# EAGLE schematic elk-board (EAGLE 9.4.2)
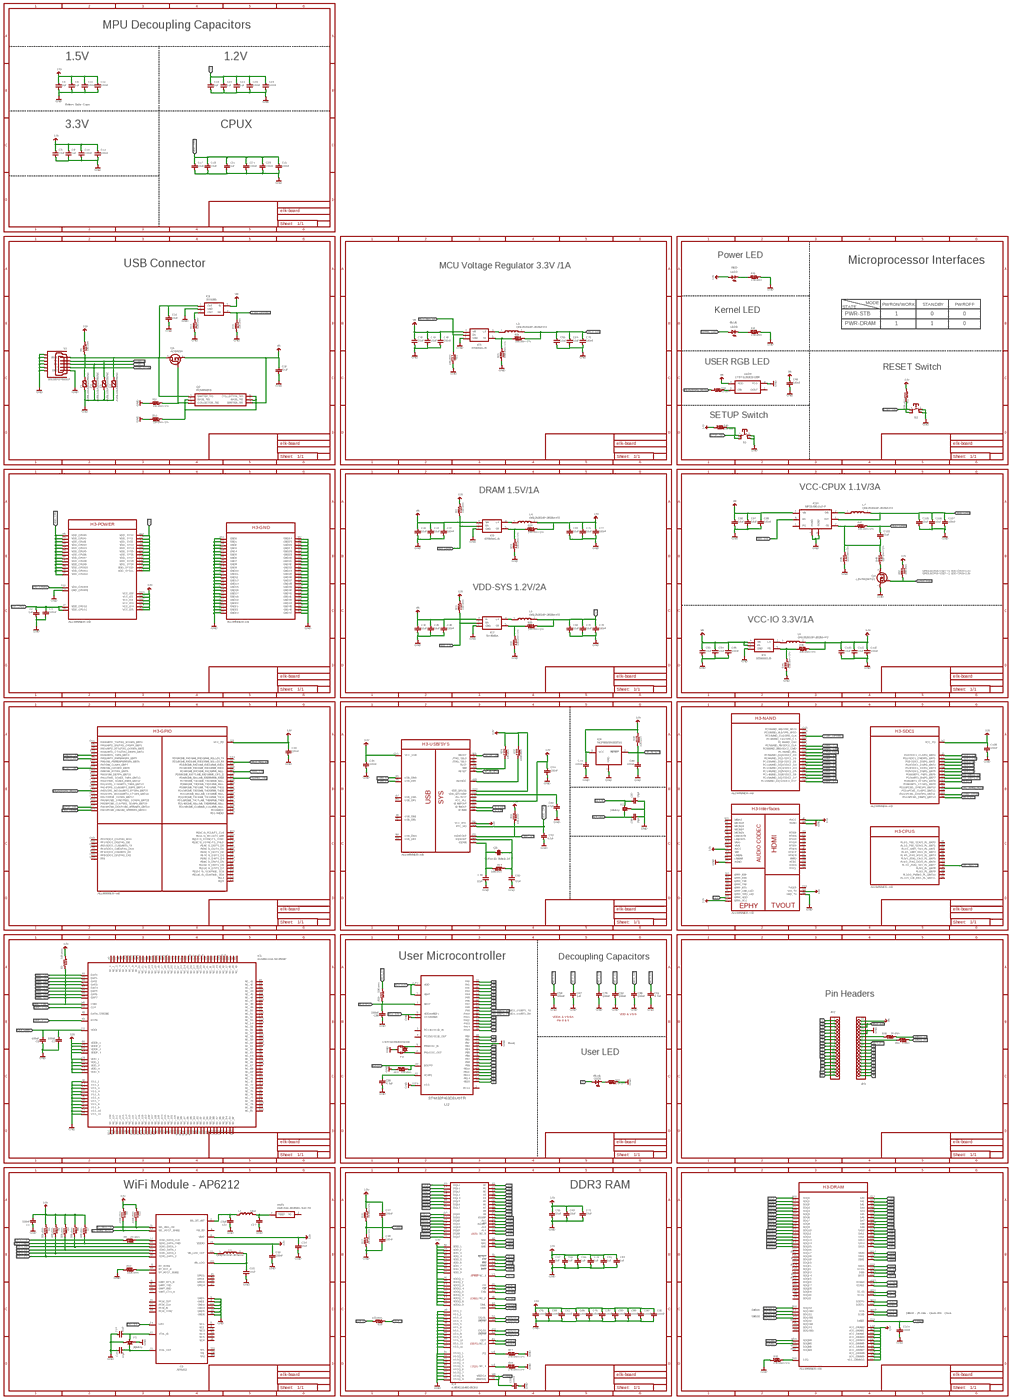
[diagram p0: schematic, sheet 1, overview]
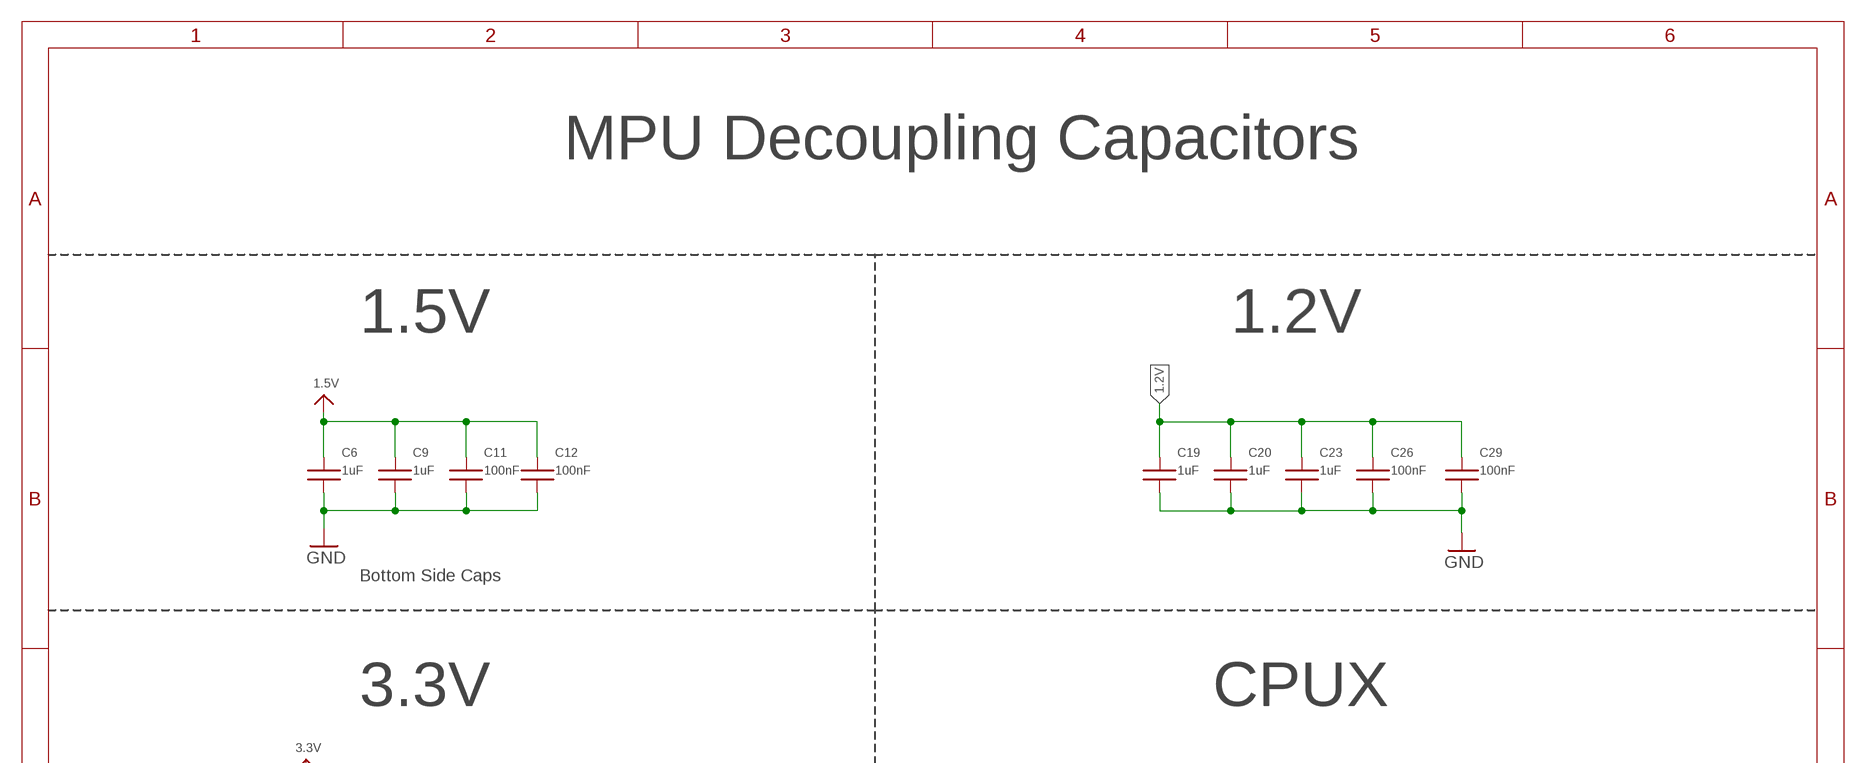
[diagram p1: schematic, sheet 1, part 1 of 7]
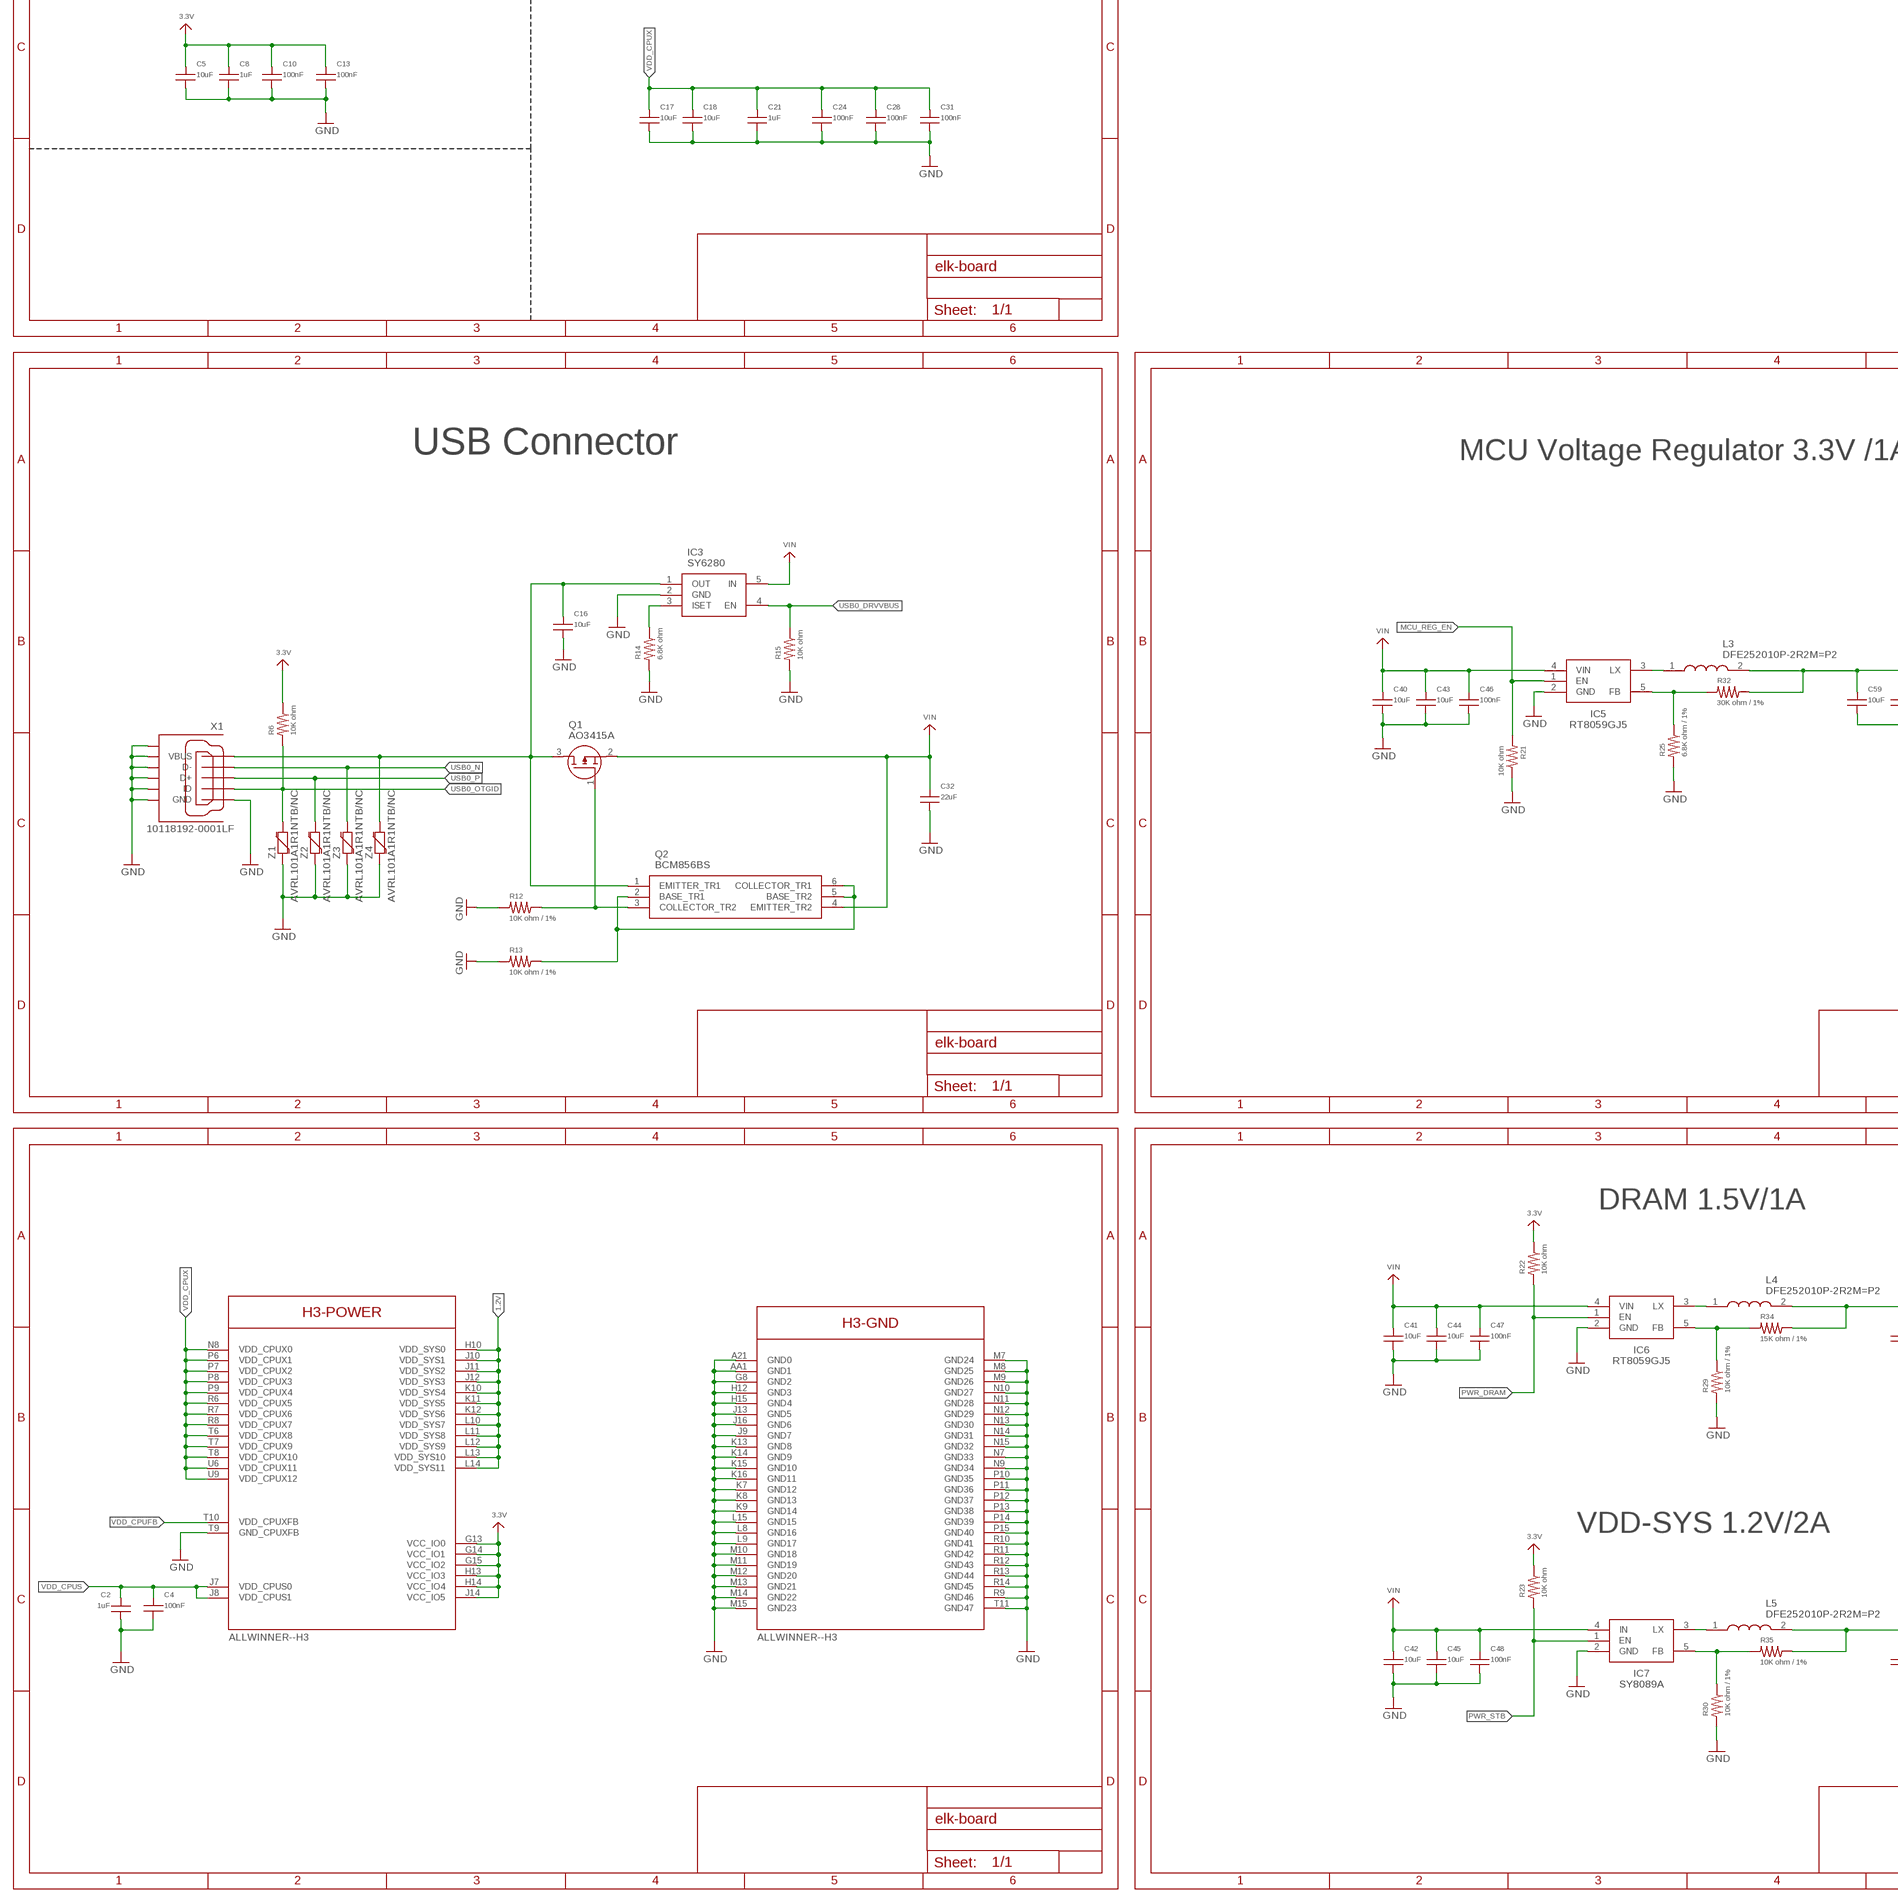
[diagram p2: schematic, sheet 1, part 2 of 7]
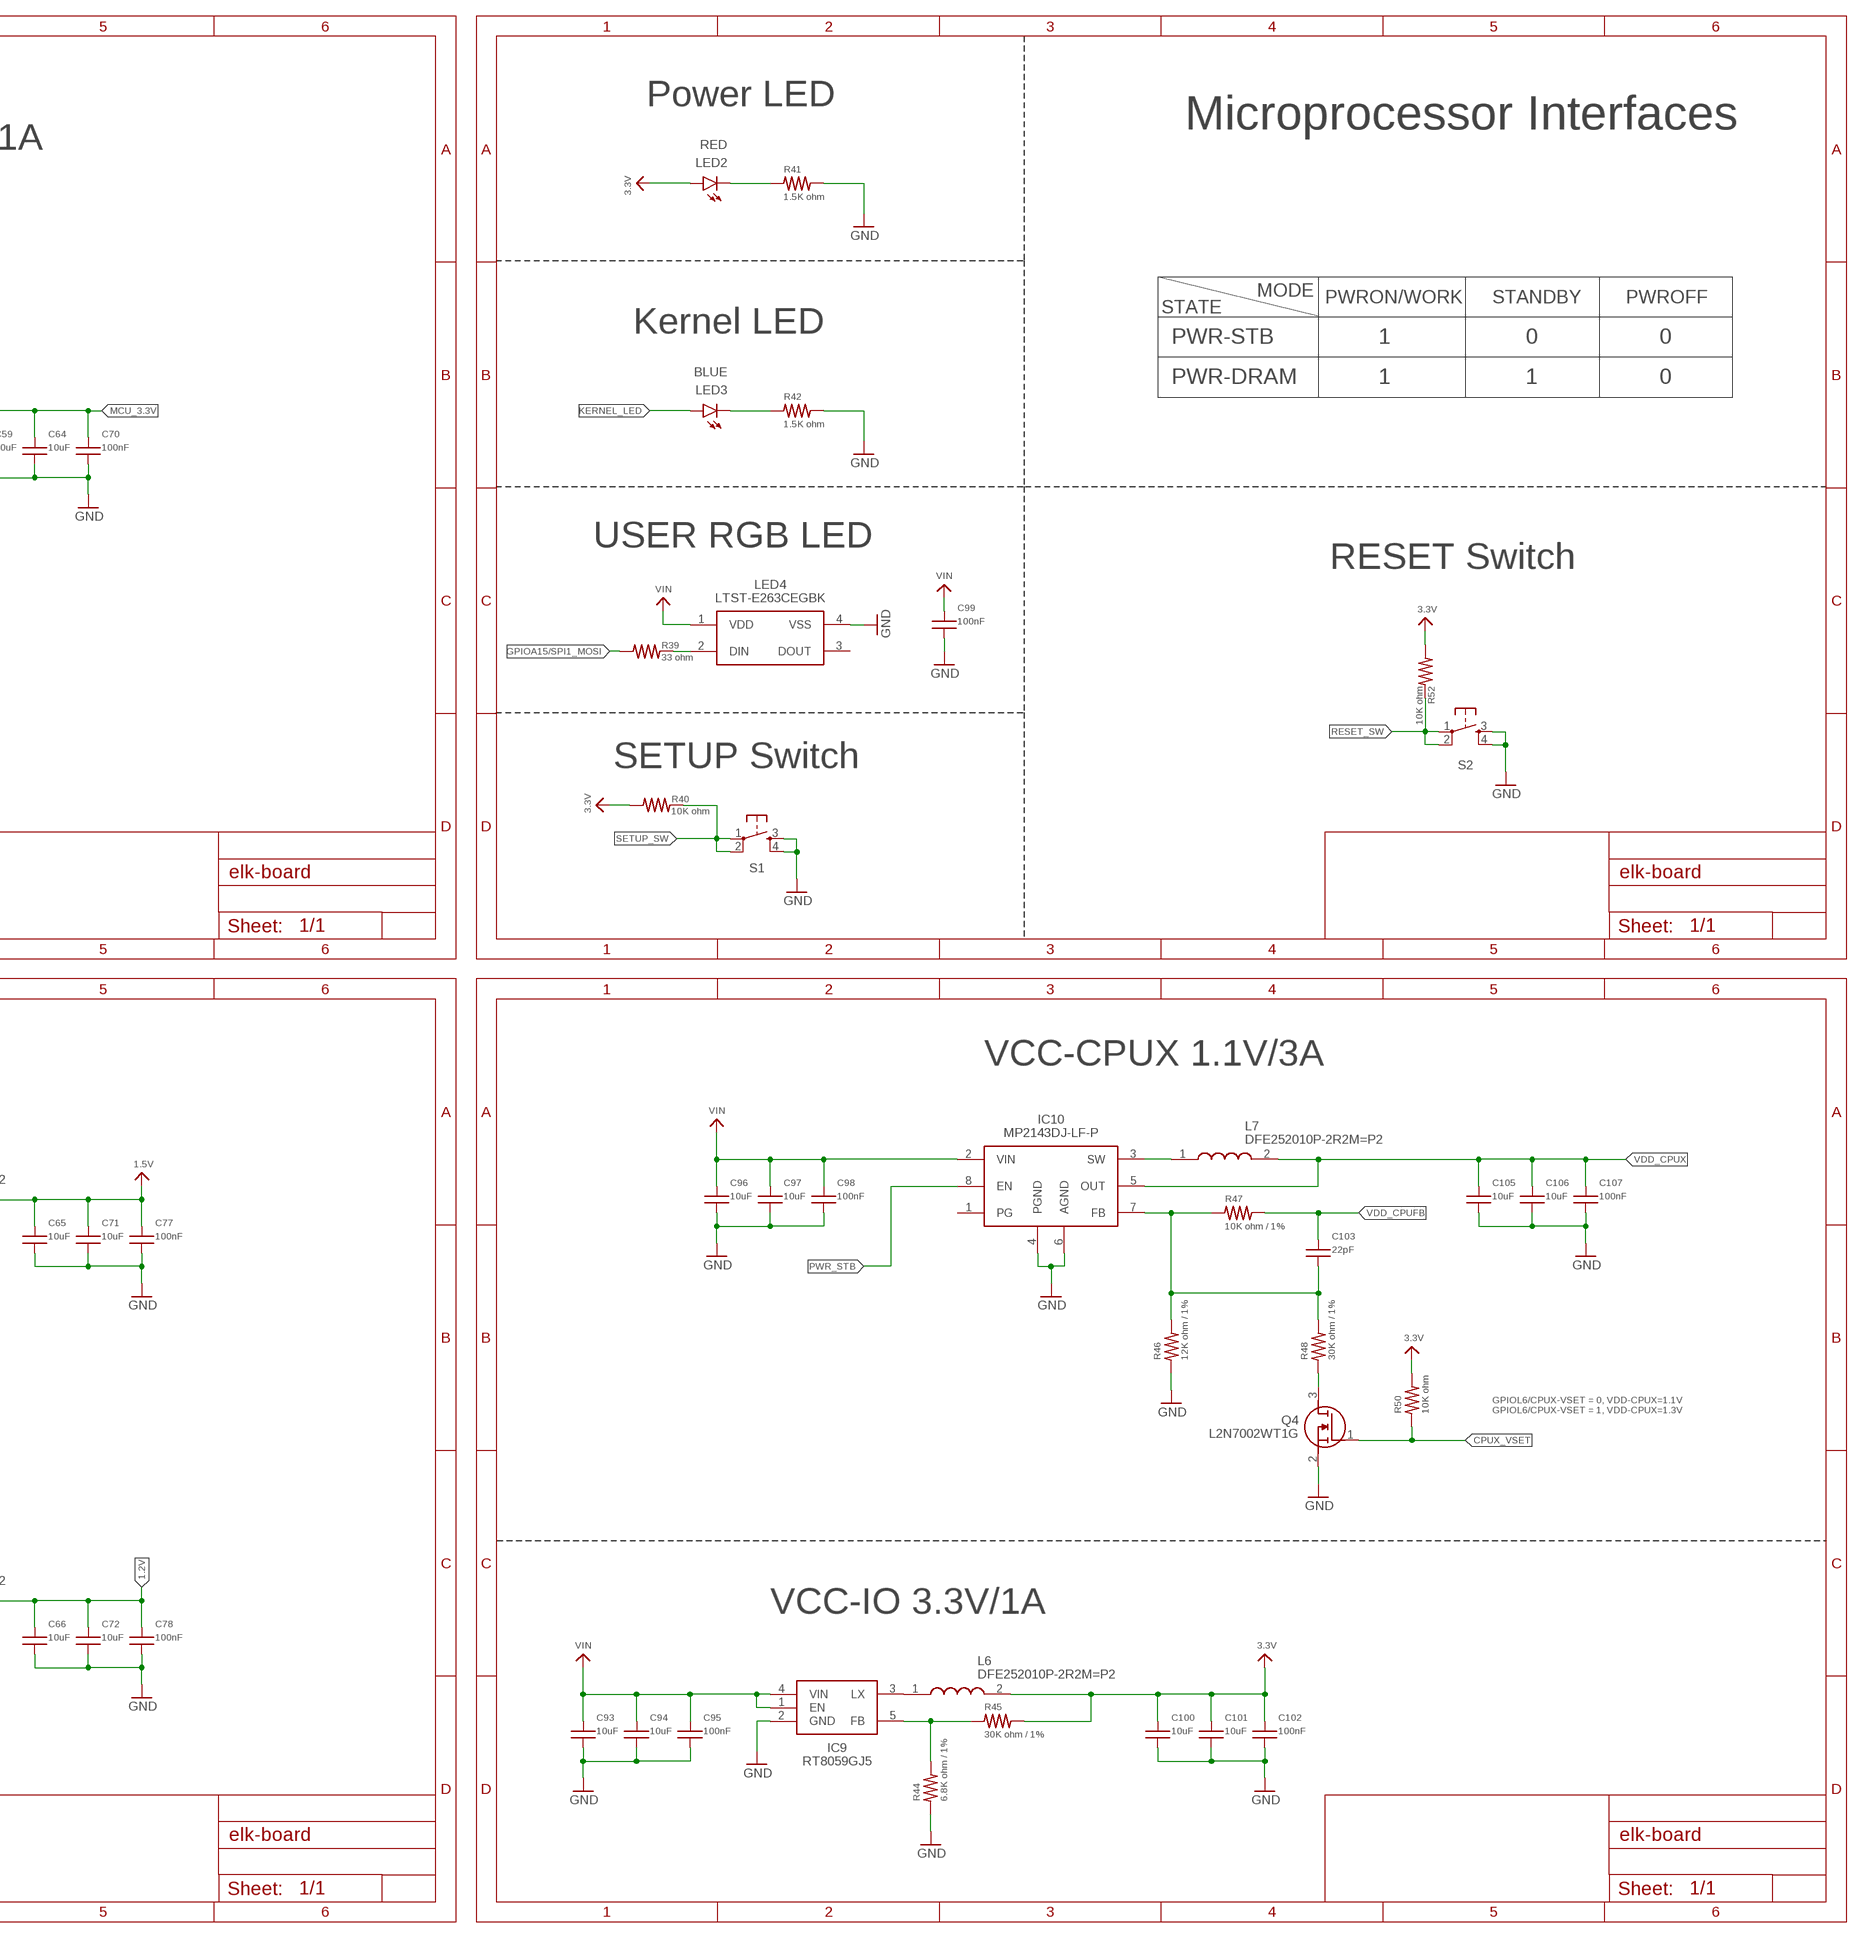
[diagram p3: schematic, sheet 1, part 3 of 7]
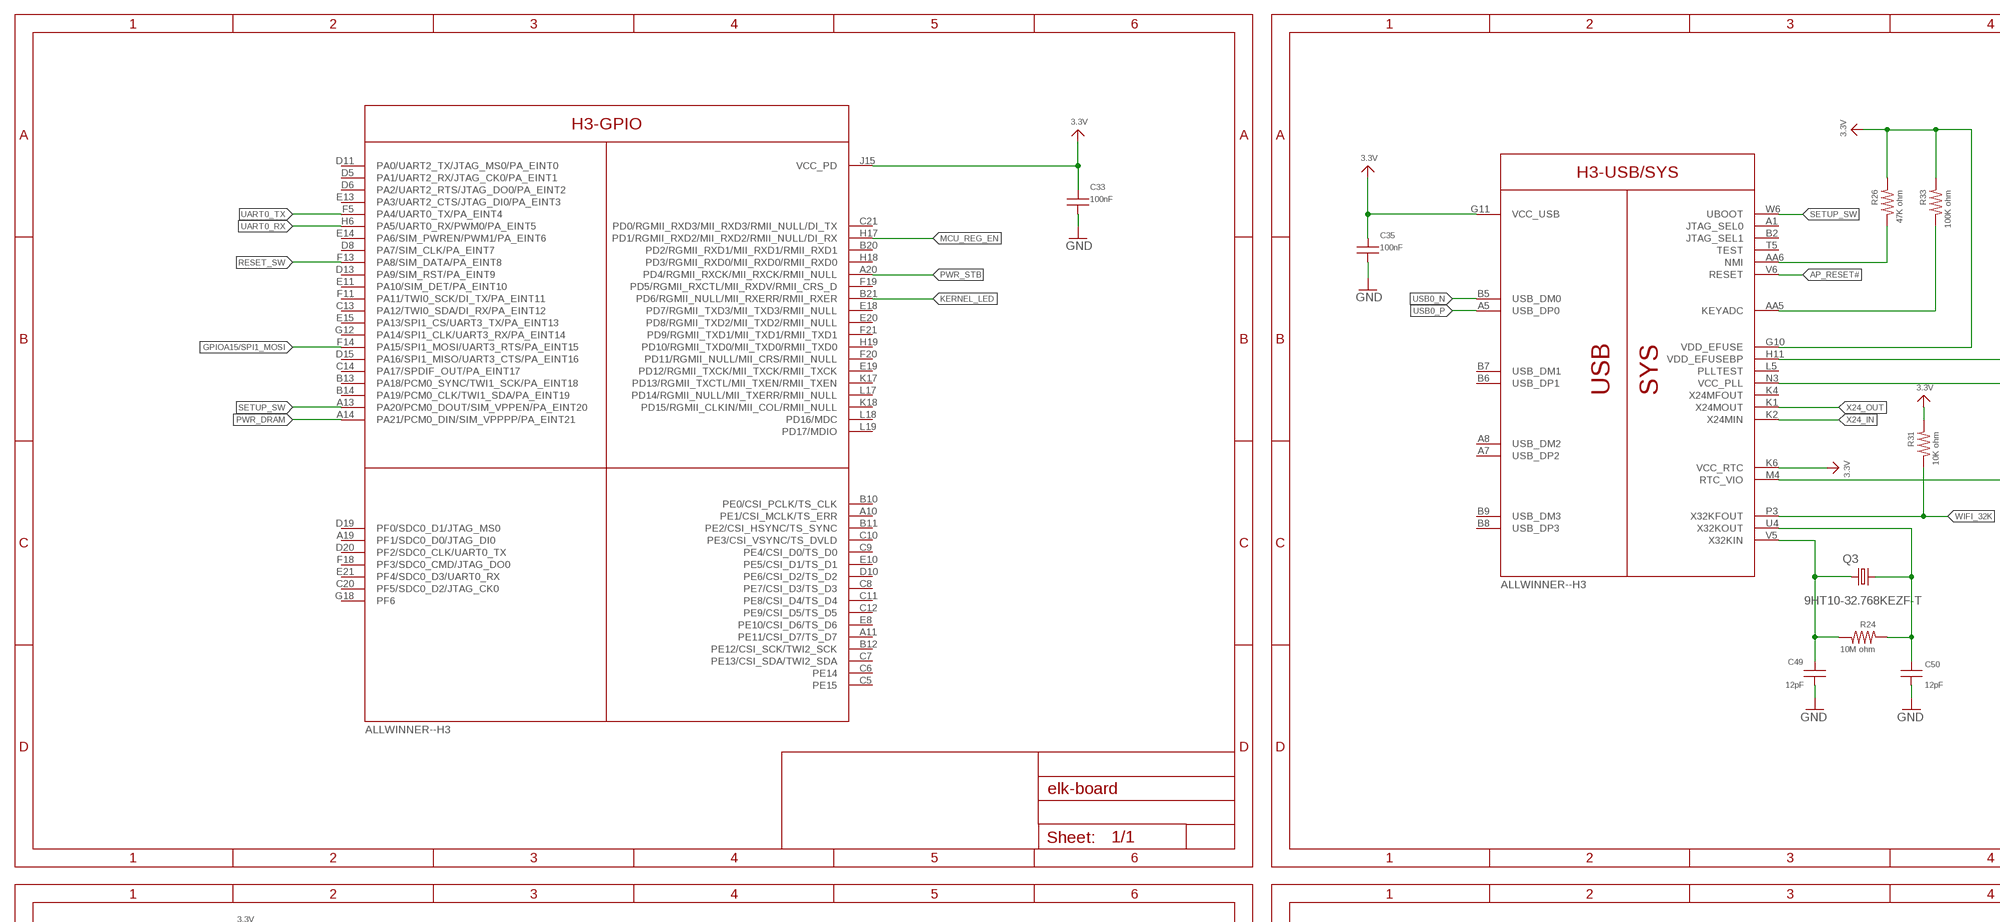
[diagram p4: schematic, sheet 1, part 4 of 7]
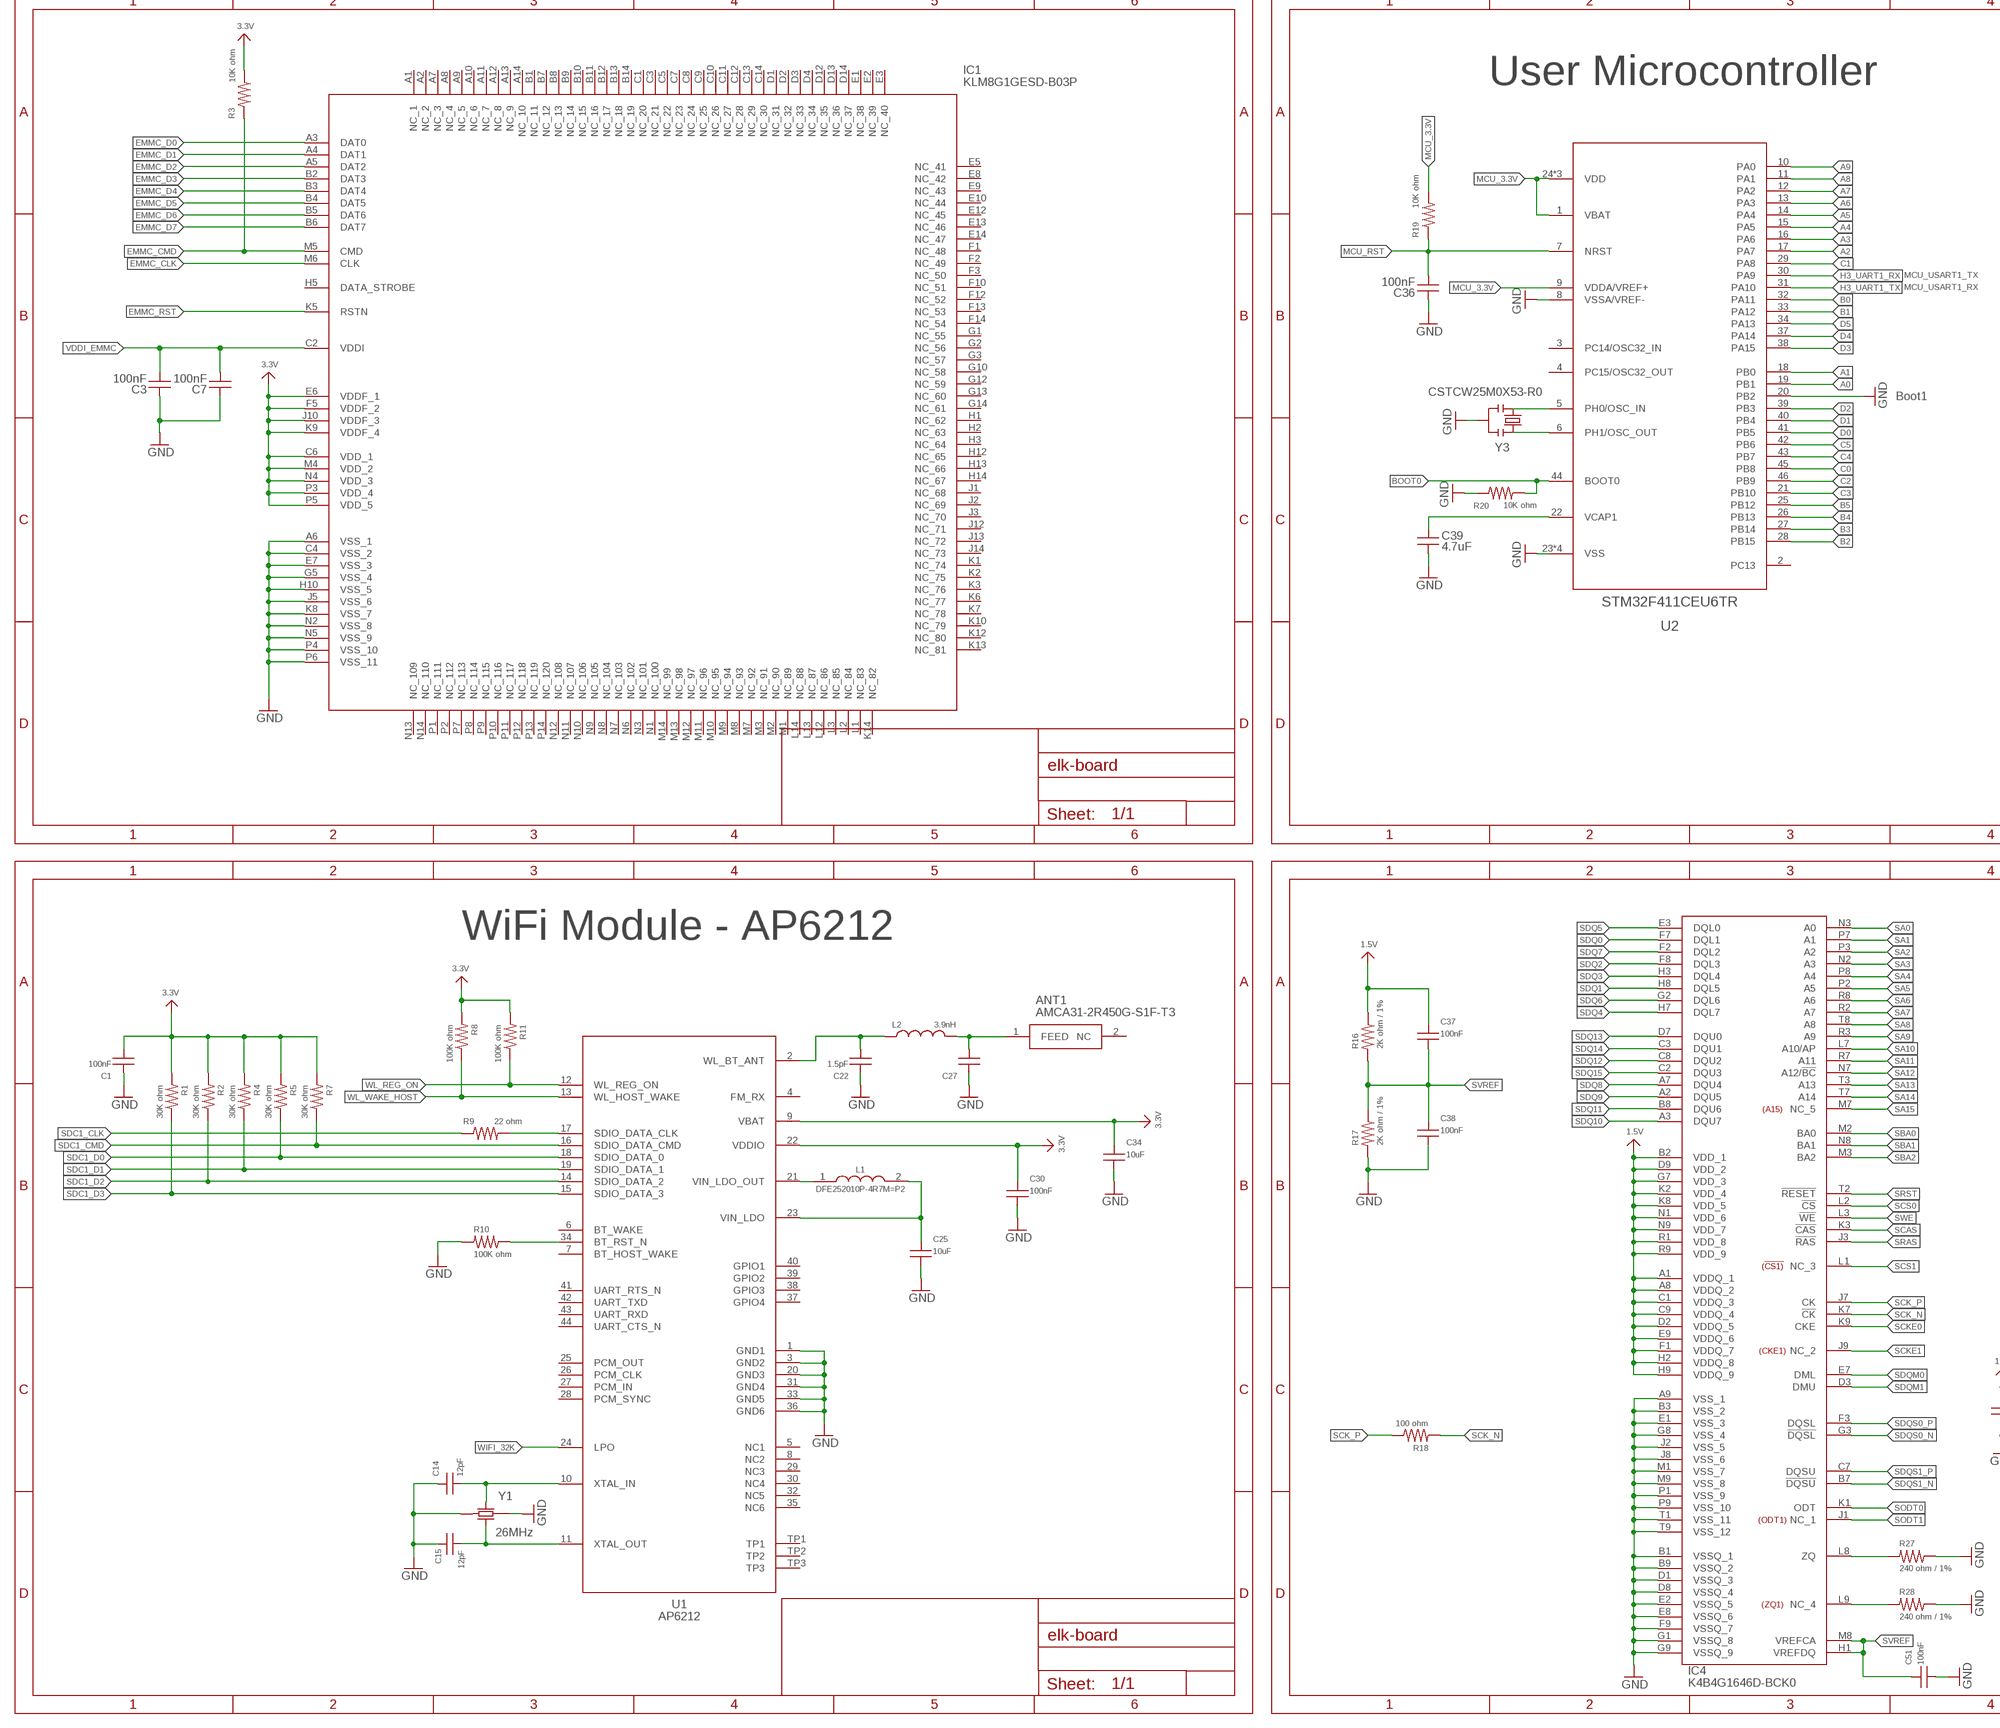
[diagram p5: schematic, sheet 1, part 5 of 7]
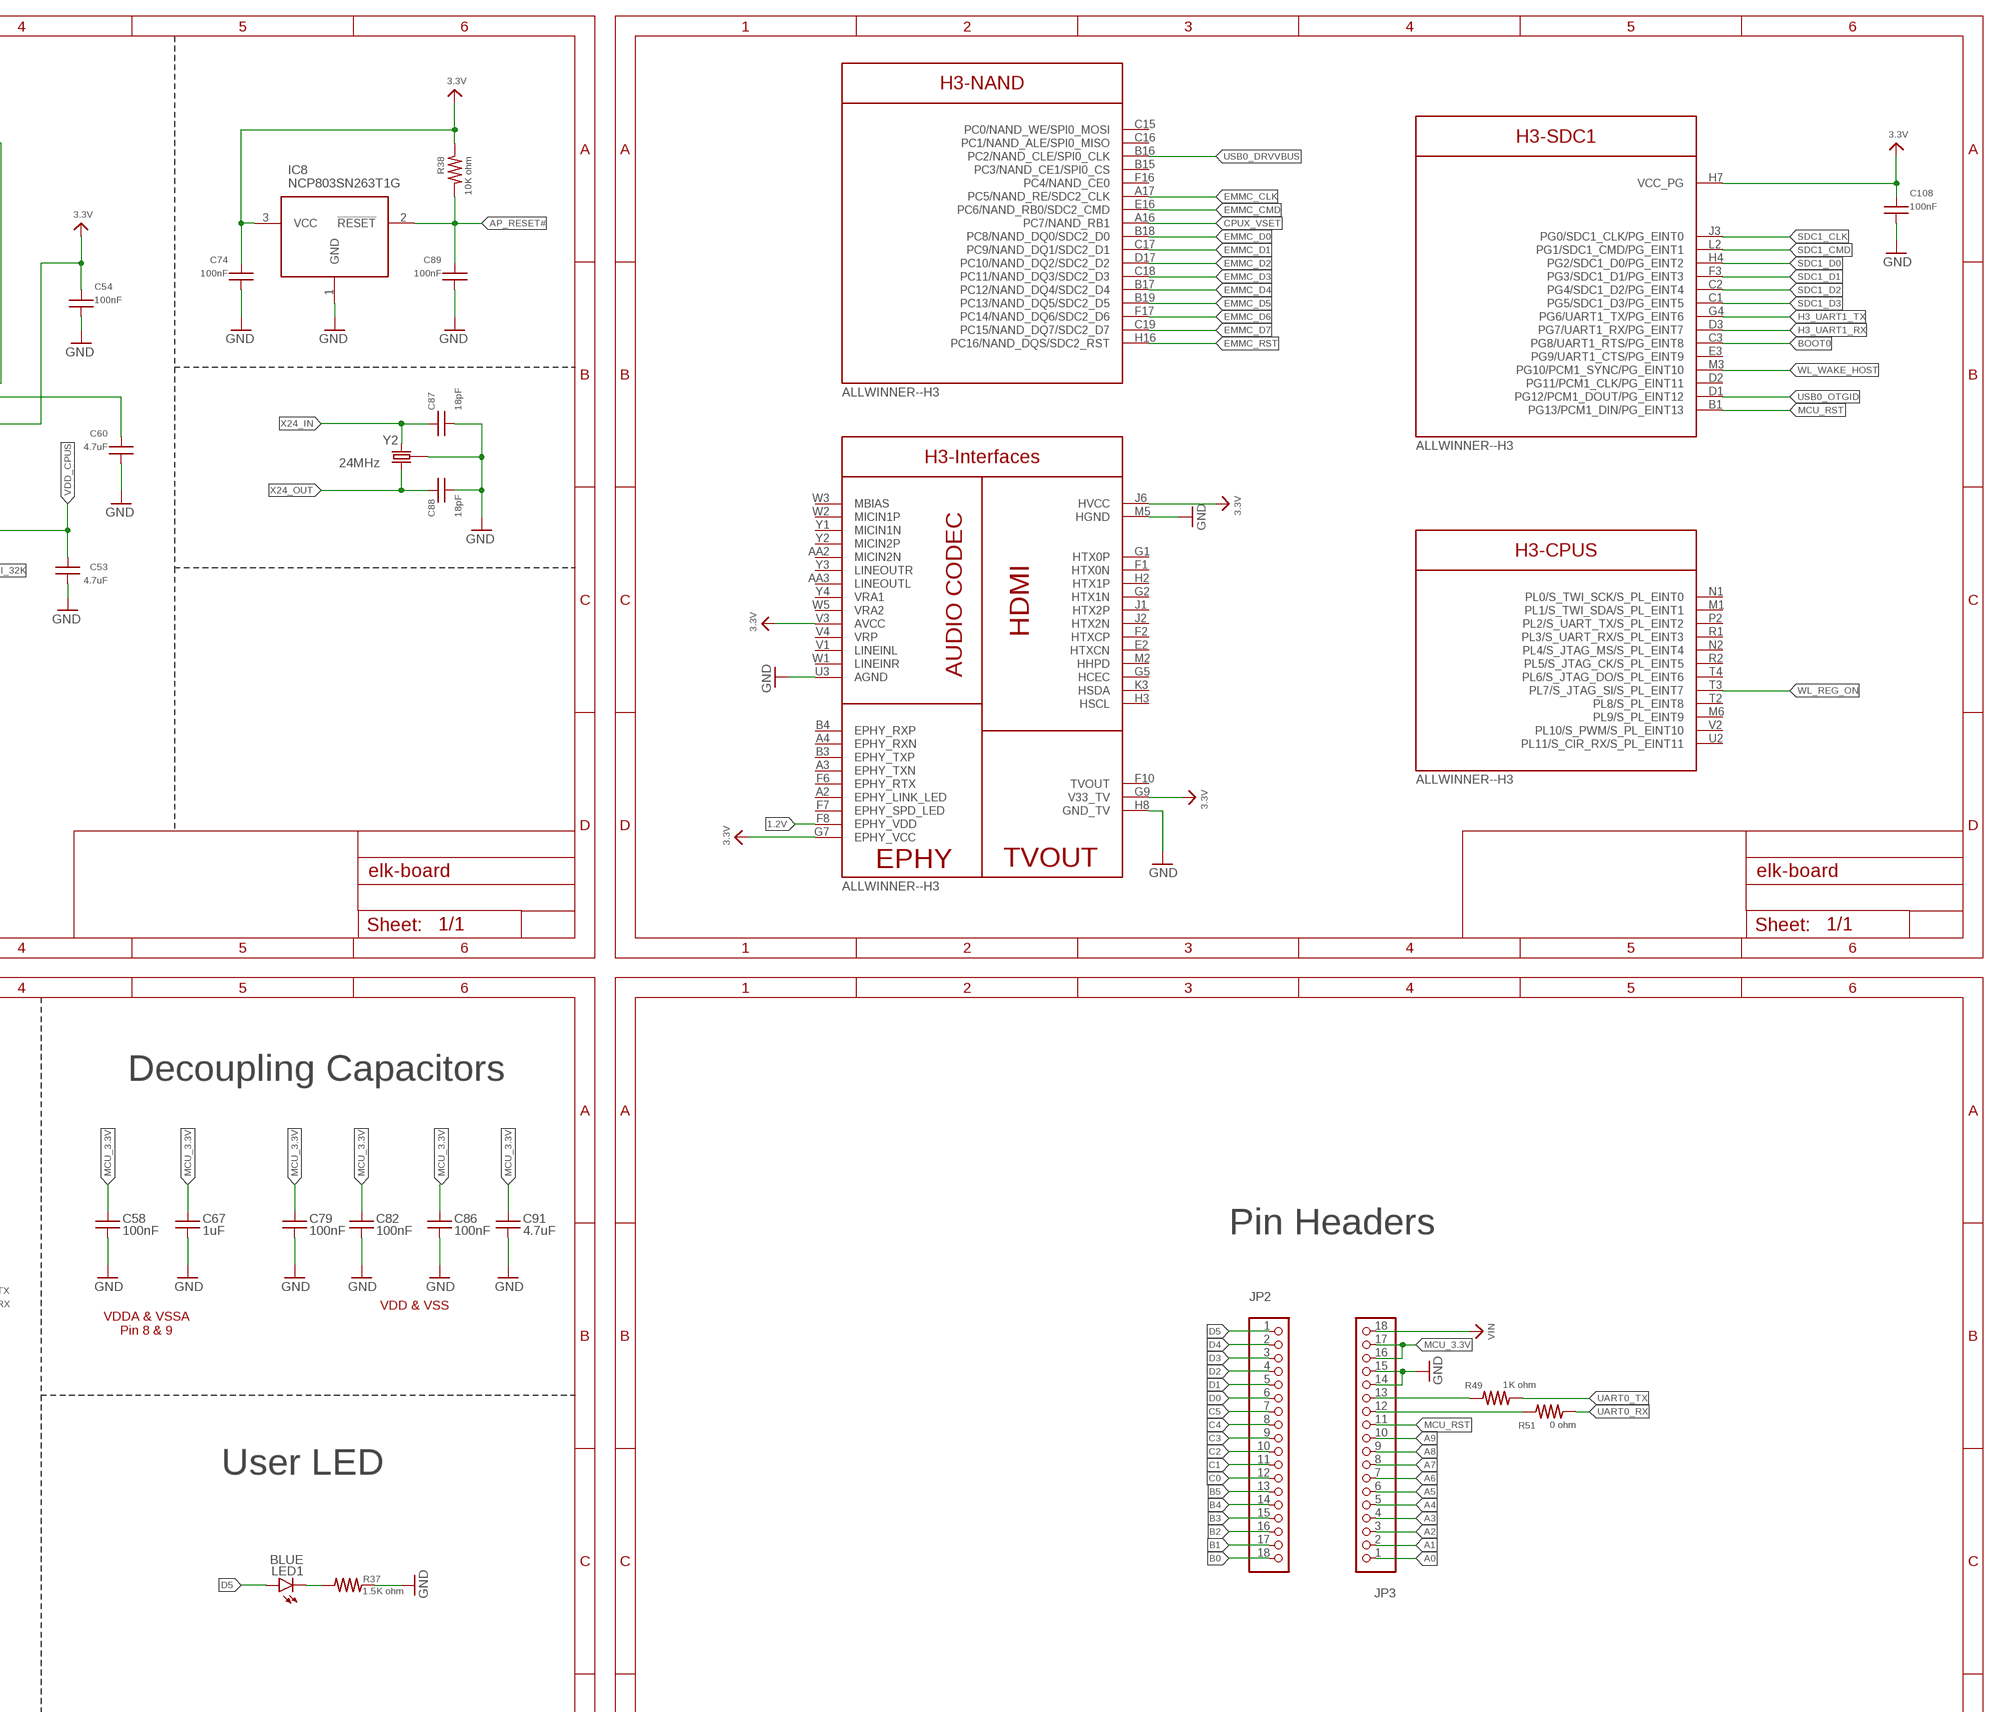
[diagram p6: schematic, sheet 1, part 6 of 7]
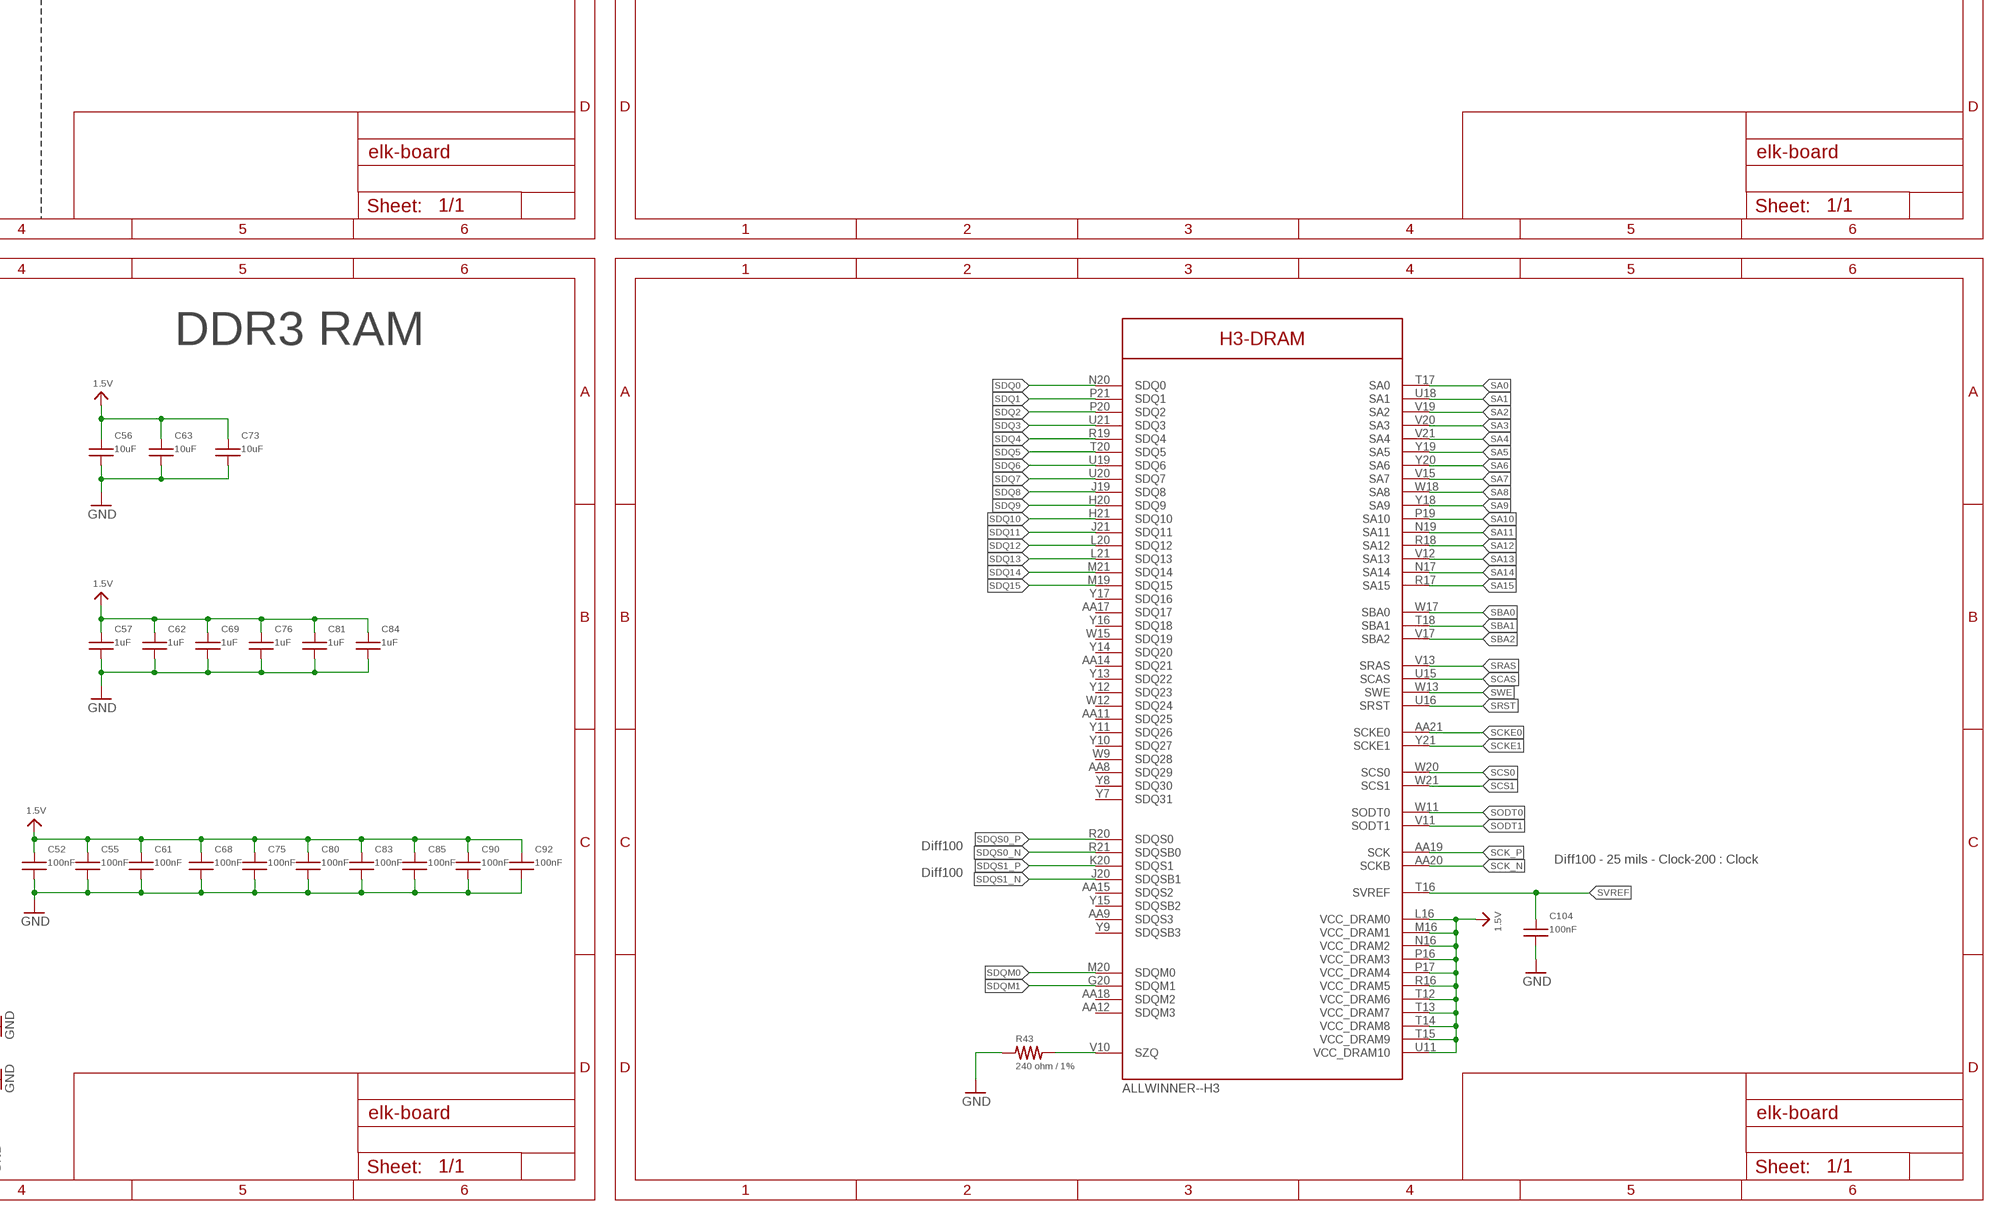
[diagram p7: schematic, sheet 1, part 7 of 7]

## Parts
ANT1  AMCA31-2R450G-S1F-T3  [ANTC3216X140N]
C1  100nF  CAPACITOR-(INCH)-0402  [0402]
C2  1uF  CAPACITOR-(INCH)-0402  [0402]
C3  100nF  CAPACITOR-(INCH)-0402  [0402]
C4  100nF  CAPACITOR-(INCH)-0402  [0402]
C5  10uF  CAPACITOR-(INCH)-0603  [0603]
C6  1uF  CAPACITOR-(INCH)-0402  [0402]
C7  100nF  CAPACITOR-(INCH)-0402  [0402]
C8  1uF  CAPACITOR-(INCH)-0402  [0402]
C9  1uF  CAPACITOR-(INCH)-0402  [0402]
C10  100nF  CAPACITOR-(INCH)-0402  [0402]
C11  100nF  CAPACITOR-(INCH)-0402  [0402]
C12  100nF  CAPACITOR-(INCH)-0402  [0402]
C13  100nF  CAPACITOR-(INCH)-0402  [0402]
C14  12pF  CAPACITOR-(INCH)-0402  [0402]
C15  12pF  CAPACITOR-(INCH)-0402  [0402]
C16  10uF  CAPACITOR-(INCH)-0603  [0603]
C17  10uF  TOLBA_CAP  [TOLBA_0603]
C18  10uF  TOLBA_CAP  [TOLBA_0603]
C19  1uF  CAPACITOR-(INCH)-0402  [0402]
C20  1uF  CAPACITOR-(INCH)-0402  [0402]
C21  1uF  CAPACITOR-(INCH)-0402  [0402]
C22  1.5pF  CAPACITOR-(INCH)-0402  [0402]
C23  1uF  CAPACITOR-(INCH)-0402  [0402]
C24  100nF  CAPACITOR-(INCH)-0402  [0402]
C25  10uF  CAPACITOR-(INCH)-0603  [0603]
C26  100nF  CAPACITOR-(INCH)-0402  [0402]
C27  CAPACITOR-(INCH)-0402  [0402]
C28  100nF  CAPACITOR-(INCH)-0402  [0402]
C29  100nF  CAPACITOR-(INCH)-0402  [0402]
C30  100nF  CAPACITOR-(INCH)-0402  [0402]
C31  100nF  CAPACITOR-(INCH)-0402  [0402]
C32  22uF  CAPACITOR-(INCH)-0603  [0603]
C33  100nF  CAPACITOR-(INCH)-0402  [0402]
C34  10uF  CAPACITOR-(INCH)-0603  [0603]
C35  100nF  CAPACITOR-(INCH)-0402  [0402]
C36  100nF  CAPACITOR-(INCH)-0402  [0402]
C37  100nF  CAPACITOR-(INCH)-0402  [0402]
C38  100nF  CAPACITOR-(INCH)-0402  [0402]
C39  4.7uF  CAPACITOR-(INCH)-0402  [0402]
C40  10uF  CAPACITOR-(INCH)-0603  [0603]
C41  10uF  CAPACITOR-(INCH)-0603  [0603]
C42  10uF  CAPACITOR-(INCH)-0603  [0603]
C43  10uF  CAPACITOR-(INCH)-0603  [0603]
C44  10uF  CAPACITOR-(INCH)-0603  [0603]
C45  10uF  CAPACITOR-(INCH)-0603  [0603]
C46  100nF  CAPACITOR-(INCH)-0402  [0402]
C47  100nF  CAPACITOR-(INCH)-0402  [0402]
C48  100nF  CAPACITOR-(INCH)-0402  [0402]
C49  12pF  CAPACITOR-(INCH)-0402  [0402]
C50  12pF  CAPACITOR-(INCH)-0402  [0402]
C51  100nF  CAPACITOR-(INCH)-0402  [0402]
C52  100nF  CAPACITOR-(INCH)-0402  [0402]
C53  4.7uF  CAPACITOR-(INCH)-0402  [0402]
C54  100nF  CAPACITOR-(INCH)-0402  [0402]
C55  100nF  CAPACITOR-(INCH)-0402  [0402]
C56  10uF  CAPACITOR-(INCH)-0603  [0603]
C57  1uF  CAPACITOR-(INCH)-0402  [0402]
C58  100nF  CAPACITOR-(INCH)-0402  [0402]
C59  10uF  CAPACITOR-(INCH)-0603  [0603]
C60  4.7uF  CAPACITOR-(INCH)-0402  [0402]
C61  100nF  CAPACITOR-(INCH)-0402  [0402]
C62  1uF  CAPACITOR-(INCH)-0402  [0402]
C63  10uF  CAPACITOR-(INCH)-0603  [0603]
C64  10uF  CAPACITOR-(INCH)-0603  [0603]
C65  10uF  CAPACITOR-(INCH)-0603  [0603]
C66  10uF  CAPACITOR-(INCH)-0603  [0603]
C67  1uF  CAPACITOR-(INCH)-0402  [0402]
C68  100nF  CAPACITOR-(INCH)-0402  [0402]
C69  1uF  CAPACITOR-(INCH)-0402  [0402]
C70  100nF  CAPACITOR-(INCH)-0402  [0402]
C71  10uF  CAPACITOR-(INCH)-0603  [0603]
C72  10uF  CAPACITOR-(INCH)-0603  [0603]
C73  10uF  CAPACITOR-(INCH)-0603  [0603]
C74  100nF  CAPACITOR-(INCH)-0402  [0402]
C75  100nF  CAPACITOR-(INCH)-0402  [0402]
C76  1uF  CAPACITOR-(INCH)-0402  [0402]
C77  100nF  CAPACITOR-(INCH)-0402  [0402]
C78  100nF  CAPACITOR-(INCH)-0402  [0402]
C79  100nF  CAPACITOR-(INCH)-0402  [0402]
C80  100nF  CAPACITOR-(INCH)-0402  [0402]
C81  1uF  CAPACITOR-(INCH)-0402  [0402]
C82  100nF  CAPACITOR-(INCH)-0402  [0402]
C83  100nF  CAPACITOR-(INCH)-0402  [0402]
C84  1uF  CAPACITOR-(INCH)-0402  [0402]
C85  100nF  CAPACITOR-(INCH)-0402  [0402]
C86  100nF  CAPACITOR-(INCH)-0402  [0402]
C87  18pF  CAPACITOR-(INCH)-0402  [0402]
C88  18pF  CAPACITOR-(INCH)-0402  [0402]
C89  100nF  CAPACITOR-(INCH)-0402  [0402]
C90  100nF  CAPACITOR-(INCH)-0402  [0402]
C91  4.7uF  CAPACITOR-(INCH)-0402  [0402]
C92  100nF  CAPACITOR-(INCH)-0402  [0402]
C93  10uF  CAPACITOR-(INCH)-0603  [0603]
C94  10uF  CAPACITOR-(INCH)-0603  [0603]
C95  100nF  CAPACITOR-(INCH)-0402  [0402]
C96  10uF  CAPACITOR-(INCH)-0603  [0603]
C97  10uF  CAPACITOR-(INCH)-0603  [0603]
C98  100nF  CAPACITOR-(INCH)-0402  [0402]
C99  100nF  CAPACITOR-(INCH)-0402  [0402]
C100  10uF  CAPACITOR-(INCH)-0603  [0603]
C101  10uF  CAPACITOR-(INCH)-0603  [0603]
C102  100nF  CAPACITOR-(INCH)-0402  [0402]
C103  22pF  CAPACITOR-(INCH)-0402  [0402]
C104  100nF  CAPACITOR-(INCH)-0402  [0402]
C105  10uF  TOLBA_CAP  [TOLBA_0603]
C106  10uF  TOLBA_CAP  [TOLBA_0603]
C107  100nF  CAPACITOR-(INCH)-0402  [0402]
C108  100nF  CAPACITOR-(INCH)-0402  [0402]
IC1  KLM8G1GESD-B03P  [BGA153C50P14X14_1150X1300X80]
IC2  ALLWINNER--H3  [BGA347C65P21X21_1400X1400X118]
IC3  SY6280  [SOT95P285X140-5N]
IC4  K4B4G1646D-BCK0  K4B4G1646B-BCK0  [BGA96C80P9X16_1000X1330X120]
IC5  RT8059GJ5  [SOT94P280X100-5N]
IC6  RT8059GJ5  [SOT94P280X100-5N]
IC7  SY8089A  [SOT95P285X140-5N]
IC8  NCP803SN263T1G  [SOT96P237X111-3N]
IC9  RT8059GJ5  [SOT94P280X100-5N]
IC10  MP2143DJ-LF-P  [SOT65P280X100-8N]
JP2  PINHD-1X18_2.54-S  [1X18-S]
JP3  PINHD-1X18_2.54-S  [1X18-S]
L1  DFE252010P-4R7M=P2  [INDC2520X100N]
L2  3.9nH  INDUCTOR_0402_L  [RESC0402_L]
L3  DFE252010P-2R2M=P2  [INDC2520X100N]
L4  DFE252010P-2R2M=P2  [INDC2520X100N]
L5  DFE252010P-2R2M=P2  [INDC2520X100N]
L6  DFE252010P-2R2M=P2  [INDC2520X100N]
L7  DFE252010P-2R2M=P2  [INDC2520X100N]
LED1  BLUE  LED-(INCH)-0603  [0603-LED]
LED2  RED  LED-(INCH)-0603  [0603-LED]
LED3  BLUE  LED-(INCH)-0603  [0603-LED]
LED4  LTST-E263CEGBK  [LTST-E263CEGBK]
Q1  AO3415A  [SOT95P280X125-3N]
Q2  BCM856BS  [SOT65P210X110-6N]
Q3  9HT10-32.768KEZF-T  KX-327-NHT  [3.2X1.5]
Q4  L2N7002WT1G  [SOT65P220X100-3N]
R1  30K ohm  RESISTOR-(INCH)-0402  [0402]
R2  30K ohm  RESISTOR-(INCH)-0402  [0402]
R3  10K ohm  RESISTOR-(INCH)-0402  [0402]
R4  30K ohm  RESISTOR-(INCH)-0402  [0402]
R5  30K ohm  RESISTOR-(INCH)-0402  [0402]
R6  10K ohm  RESISTOR-(INCH)-0402  [0402]
R7  30K ohm  RESISTOR-(INCH)-0402  [0402]
R8  100K ohm  RESISTOR-(INCH)-0402  [0402]
R9  22 ohm  RESISTOR-(INCH)-0402  [0402]
R10  100K ohm  RESISTOR-(INCH)-0402  [0402]
R11  100K ohm  RESISTOR-(INCH)-0402  [0402]
R12  10K ohm / 1%  RESISTOR-(INCH)-0402  [0402]
R13  10K ohm / 1%  RESISTOR-(INCH)-0402  [0402]
R14  6.8K ohm  RESISTOR-(INCH)-0402  [0402]
R15  10K ohm  RESISTOR-(INCH)-0402  [0402]
R16  2K ohm / 1%  RESISTOR-(INCH)-0402  [0402]
R17  2K ohm / 1%  RESISTOR-(INCH)-0402  [0402]
R18  100 ohm  RESISTOR-(INCH)-0402  [0402]
R19  10K ohm  RESISTOR-(INCH)-0402  [0402]
R20  10K ohm  RESISTOR-(INCH)-0402  [0402]
R21  10K ohm  RESISTOR-(INCH)-0402  [0402]
R22  10K ohm  RESISTOR-(INCH)-0402  [0402]
R23  10K ohm  RESISTOR-(INCH)-0402  [0402]
R24  10M ohm  RESISTOR-(INCH)-0402  [0402]
R25  6.8K ohm / 1%  RESISTOR-(INCH)-0402  [0402]
R26  47K ohm  RESISTOR-(INCH)-0402  [0402]
R27  240 ohm / 1%  RESISTOR-(INCH)-0402  [0402]
R28  240 ohm / 1%  RESISTOR-(INCH)-0402  [0402]
R29  10K ohm / 1%  RESISTOR-(INCH)-0402  [0402]
R30  10K ohm / 1%  RESISTOR-(INCH)-0402  [0402]
R31  10K ohm  RESISTOR-(INCH)-0402  [0402]
R32  30K ohm / 1%  RESISTOR-(INCH)-0402  [0402]
R33  100K ohm  RESISTOR-(INCH)-0402  [0402]
R34  15K ohm / 1%  RESISTOR-(INCH)-0402  [0402]
R35  10K ohm / 1%  RESISTOR-(INCH)-0402  [0402]
R37  1.5K ohm  RESISTOR-(INCH)-0402  [0402]
R38  10K ohm  RESISTOR-(INCH)-0402  [0402]
R39  33 ohm  RESISTOR-(INCH)-0402  [0402]
R40  10K ohm  RESISTOR-(INCH)-0402  [0402]
R41  1.5K ohm  RESISTOR-(INCH)-0402  [0402]
R42  1.5K ohm  RESISTOR-(INCH)-0402  [0402]
R43  240 ohm / 1%  RESISTOR-(INCH)-0402  [0402]
R44  6.8K ohm / 1%  RESISTOR-(INCH)-0402  [0402]
R45  30K ohm / 1%  RESISTOR-(INCH)-0402  [0402]
R46  12K ohm / 1%  RESISTOR-(INCH)-0402  [0402]
R47  10K ohm / 1%  RESISTOR-(INCH)-0402  [0402]
R48  30K ohm / 1%  RESISTOR-(INCH)-0402  [0402]
R49  1K ohm  RESISTOR-(INCH)-0402  [0402]
R50  10K ohm  RESISTOR-(INCH)-0402  [0402]
R51  0 ohm  RESISTOR-(INCH)-0402  [0402]
R52  10K ohm  RESISTOR-(INCH)-0402  [0402]
S1  KMR231GLFS  TAC_SWITCHSMD  [TACTILE_SWITCH_SMD]
S2  KMR231GLFS  TAC_SWITCHSMD  [TACTILE_SWITCH_SMD]
U1  AP6212  [AP6212]
U2  STM32F411CEU6TR  STM32F411CEU6  [UFQFPN-48]
X1  10118192-0001LF  [10118192-0001LF(MICRO-USB-B-AMPHENOL-FCI)]
Y1  26MHz  FA-12826.0000MF10Z-W5  [4-SMD-2X1.6MM]
Y2  24MHz  CRYSTAL-24MHZ-EPSON-TSX-3225  [CRYSTAL-SMD-3.2X2.5MM-EPSON-TSX-3225]
Y3  CSTCW25M0X53-R0  [CSTCW25M0X53-R0]
Z1  AVRL101A1R1NTB/NC  VARISTOR-0402  [0402-RES]
Z2  AVRL101A1R1NTB/NC  VARISTOR-0402  [0402-RES]
Z3  AVRL101A1R1NTB/NC  VARISTOR-0402  [0402-RES]
Z4  AVRL101A1R1NTB/NC  VARISTOR-0402  [0402-RES]

## Nets
1.2V [1.2V]: C19.1 C20.1 C23.1 C26.1 C29.1 C66.1 C72.1 C78.1 IC2.F8(EPHY_VDD) IC2.H10(VDD_SYS0) IC2.J10(VDD_SYS1) IC2.J11(VDD_SYS2) IC2.J12(VDD_SYS3) IC2.K10(VDD_SYS4) IC2.K11(VDD_SYS5) IC2.K12(VDD_SYS6) IC2.L10(VDD_SYS7) IC2.L11(VDD_SYS8) IC2.L12(VDD_SYS9) IC2.L13(VDD_SYS10) IC2.L14(VDD_SYS11) L5.2 R35.2
1.5V [1.5V]: C6.1 C9.1 C11.1 C12.1 C37.1 C52.1 C55.1 C56.1 C57.1 C61.1 C62.1 C63.1 C65.1 C68.1 C69.1 C71.1 C73.1 C75.1 C76.1 C77.1 C80.1 C81.1 C83.1 C84.1 C85.1 C90.1 C92.1 IC2.L16(VCC_DRAM0) IC2.M16(VCC_DRAM1) IC2.N16(VCC_DRAM2) IC2.P16(VCC_DRAM3) IC2.P17(VCC_DRAM4) IC2.R16(VCC_DRAM5) IC2.T12(VCC_DRAM6) IC2.T13(VCC_DRAM7) IC2.T14(VCC_DRAM8) IC2.T15(VCC_DRAM9) IC2.U11(VCC_DRAM10) IC4.A1(VDDQ_1) IC4.A8(VDDQ_2) IC4.B2(VDD_1) IC4.C1(VDDQ_3) IC4.C9(VDDQ_4) IC4.D2(VDDQ_5) IC4.D9(VDD_2) IC4.E9(VDDQ_6) IC4.F1(VDDQ_7) IC4.G7(VDD_3) IC4.H2(VDDQ_8) IC4.H9(VDDQ_9) IC4.K2(VDD_4) IC4.K8(VDD_5) IC4.N1(VDD_6) IC4.N9(VDD_7) IC4.R1(VDD_8) IC4.R9(VDD_9) L4.2 R16.2 R34.2
3.3V [3.3V]: C1.2 C5.1 C8.1 C10.1 C13.1 C30.1 C33.1 C34.1 C35.1 C54.1 C74.1 C100.1 C101.1 C102.1 C108.1 IC1.C6(VDD_1) IC1.E6(VDDF_1) IC1.F5(VDDF_2) IC1.J10(VDDF_3) IC1.K9(VDDF_4) IC1.M4(VDD_2) IC1.N4(VDD_3) IC1.P3(VDD_4) IC1.P5(VDD_5) IC2.G7(EPHY_VCC) IC2.G9(V33_TV) IC2.G10(VDD_EFUSE) IC2.G11(VCC_USB) IC2.G13(VCC_IO0) IC2.G14(VCC_IO1) IC2.G15(VCC_IO2) IC2.H7(VCC_PG) IC2.H13(VCC_IO3) IC2.H14(VCC_IO4) IC2.J6(HVCC) IC2.J14(VCC_IO5) IC2.J15(VCC_PD) IC2.K6(VCC_RTC) IC2.N3(VCC_PLL) IC2.V3(AVCC) IC8.3(VCC) L6.2 LED2.A R1.1 R2.1 R3.2 R4.1 R5.1 R6.2 R7.1 R8.1 R11.1 R22.2 R23.2 R26.1 R31.1 R33.1 R38.1 R40.1 R45.2 R50.2 R52.1 U1.9(VBAT) U1.22(VDDIO)
A0: JP3.1 U2.19(PB1)
A1: JP3.2 U2.18(PB0)
A2: JP3.3 U2.17(PA7)
A3: JP3.4 U2.16(PA6)
A4: JP3.5 U2.15(PA5)
A5: JP3.6 U2.14(PA4)
A6: JP3.7 U2.13(PA3)
A7: JP3.8 U2.12(PA2)
A8: JP3.9 U2.11(PA1)
A9: JP3.10 U2.10(PA0)
AP_RESET#: C89.1 IC2.V6(RESET) IC8.2(!RESET) R38.2
B0: JP2.18 U2.32(PA11)
B1: JP2.17 U2.33(PA12)
B2: JP2.16 U2.28(PB15)
B3: JP2.15 U2.27(PB14)
B4: JP2.14 U2.26(PB13)
B5: JP2.13 U2.25(PB12)
BOOT0: IC2.C3(PG8/UART1_RTS/PG_EINT8) R20.1 U2.44(BOOT0)
C0: JP2.12 U2.45(PB8)
C1: JP2.11 U2.29(PA8)
C2: JP2.10 U2.46(PB9)
C3: JP2.9 U2.21(PB10)
C4: JP2.8 U2.43(PB7)
C5: JP2.7 U2.42(PB6)
CPUX_VSET: IC2.A16(PC7/NAND_RB1) Q4.1(G) R50.1
D0: JP2.6 U2.41(PB5)
D1: JP2.5 U2.40(PB4)
D2: JP2.4 U2.39(PB3)
D3: JP2.3 U2.38(PA15)
D4: JP2.2 U2.37(PA14)
D5: JP2.1 LED1.A U2.34(PA13)
EMMC_CLK [SDC2]: IC1.M6(CLK) IC2.A17(PC5/NAND_RE/SDC2_CLK)
EMMC_CMD [SDC2]: IC1.M5(CMD) IC2.E16(PC6/NAND_RB0/SDC2_CMD) R3.1
EMMC_D0 [SDC2]: IC1.A3(DAT0) IC2.B18(PC8/NAND_DQ0/SDC2_D0)
EMMC_D1 [SDC2]: IC1.A4(DAT1) IC2.C17(PC9/NAND_DQ1/SDC2_D1)
EMMC_D2 [SDC2]: IC1.A5(DAT2) IC2.D17(PC10/NAND_DQ2/SDC2_D2)
EMMC_D3 [SDC2]: IC1.B2(DAT3) IC2.C18(PC11/NAND_DQ3/SDC2_D3)
EMMC_D4 [SDC2]: IC1.B3(DAT4) IC2.B17(PC12/NAND_DQ4/SDC2_D4)
EMMC_D5 [SDC2]: IC1.B4(DAT5) IC2.B19(PC13/NAND_DQ5/SDC2_D5)
EMMC_D6 [SDC2]: IC1.B5(DAT6) IC2.F17(PC14/NAND_DQ6/SDC2_D6)
EMMC_D7 [SDC2]: IC1.B6(DAT7) IC2.C19(PC15/NAND_DQ7/SDC2_D7)
EMMC_RST: IC1.K5(RSTN) IC2.H16(PC16/NAND_DQS/SDC2_RST)
GND: C1.1 C2.2 C3.1 C4.2 C5.2 C6.2 C7.1 C8.2 C9.2 C10.2 C11.2 C12.2 C13.2 C14.1 C15.1 C16.2 C17.2 C18.2 C19.2 C20.2 C21.2 C22.1 C23.2 C24.2 C25.2 C26.2 C27.1 C28.2 C29.2 C30.2 C31.2 C32.2 C33.2 C34.2 C35.2 C36.1 C38.2 C39.2 C40.2 C41.2 C42.2 C43.2 C44.2 C45.2 C46.2 C47.2 C48.2 C49.2 C50.2 C51.2 C52.2 C53.2 C54.2 C55.2 C56.2 C57.2 C58.2 C59.2 C60.2 C61.2 C62.2 C63.2 C64.2 C65.2 C66.2 C67.2 C68.2 C69.2 C70.2 C71.2 C72.2 C73.2 C74.2 C75.2 C76.2 C77.2 C78.2 C79.2 C80.2 C81.2 C82.2 C83.2 C84.2 C85.2 C86.2 C87.1 C88.1 C89.2 C90.2 C91.2 C92.2 C93.2 C94.2 C95.2 C96.2 C97.2 C98.2 C99.2 C100.2 C101.2 C102.2 C104.2 C105.2 C106.2 C107.2 C108.2 IC1.A6(VSS_1) IC1.C4(VSS_2) IC1.E7(VSS_3) IC1.G5(VSS_4) IC1.H10(VSS_5) IC1.J5(VSS_6) IC1.K8(VSS_7) IC1.N2(VSS_8) IC1.N5(VSS_9) IC1.P4(VSS_10) IC1.P6(VSS_11) IC2.A21(GND0) IC2.AA1(GND1) IC2.G8(GND2) IC2.H8(GND_TV) IC2.H12(GND3) IC2.H15(GND4) IC2.J9(GND7) IC2.J13(GND5) IC2.J16(GND6) IC2.K7(GND12) IC2.K8(GND13) IC2.K9(GND14) IC2.K13(GND8) IC2.K14(GND9) IC2.K15(GND10) IC2.K16(GND11) IC2.L8(GND16) IC2.L9(GND17) IC2.L15(GND15) IC2.M5(HGND) IC2.M7(GND24) IC2.M8(GND25) IC2.M9(GND26) IC2.M10(GND18) IC2.M11(GND19) IC2.M12(GND20) IC2.M13(GND21) IC2.M14(GND22) IC2.M15(GND23) IC2.N7(GND33) IC2.N9(GND34) IC2.N10(GND27) IC2.N11(GND28) IC2.N12(GND29) IC2.N13(GND30) IC2.N14(GND31) IC2.N15(GND32) IC2.P10(GND35) IC2.P11(GND36) IC2.P12(GND37) IC2.P13(GND38) IC2.P14(GND39) IC2.P15(GND40) IC2.R9(GND46) IC2.R10(GND41) IC2.R11(GND42) IC2.R12(GND43) IC2.R13(GND44) IC2.R14(GND45) IC2.T9(GND_CPUXFB) IC2.T11(GND47) IC2.U3(AGND) IC3.2(GND) IC4.A9(VSS_1) IC4.B1(VSSQ_1) IC4.B3(VSS_2) IC4.B9(VSSQ_2) IC4.D1(VSSQ_3) IC4.D8(VSSQ_4) IC4.E1(VSS_3) IC4.E2(VSSQ_5) IC4.E8(VSSQ_6) IC4.F9(VSSQ_7) IC4.G1(VSSQ_8) IC4.G8(VSS_4) IC4.G9(VSSQ_9) IC4.J2(VSS_5) IC4.J8(VSS_6) IC4.M1(VSS_7) IC4.M9(VSS_8) IC4.P1(VSS_9) IC4.P9(VSS_10) IC4.T1(VSS_11) IC4.T9(VSS_12) IC5.2(GND) IC6.2(GND) IC7.2(GND) IC8.1(GND) IC9.2(GND) IC10.4(PGND) IC10.6(AGND) JP3.14 JP3.15 LED4.4(VSS) Q4.2(S) R10.1 R12.1 R13.1 R14.1 R15.1 R17.1 R20.2 R21.2 R25.1 R27.2 R28.2 R29.1 R30.1 R37.2 R41.2 R42.2 R43.1 R44.1 R46.1 S1.3 S1.4 S2.3 S2.4 U1.1(GND1) U1.3(GND2) U1.20(GND3) U1.31(GND4) U1.33(GND5) U1.36(GND6) U2.8(VSSA/VREF-) U2.20(PB2) U2.23(VSS) U2.35(VSS) U2.47(VSS) U2.49(VSS) X1.CGND1(SGND1) X1.CGND2(SGND2) X1.CGND3(SGND3) X1.CGND4(SGND4) X1.CGND5(SGND5) X1.CGND6(SGND6) X1.GND Y1.2 Y1.4 Y2.2 Y2.4 Y3.GND Z1.1 Z2.1 Z3.1 Z4.1
GPIOA15/SPI1_MOSI: IC2.F14(PA15/SPI1_MOSI/UART3_RTS/PA_EINT15) R39.1
H3_UART1_RX: IC2.D3(PG7/UART1_RX/PG_EINT7) U2.30(PA9)
H3_UART1_TX: IC2.G4(PG6/UART1_TX/PG_EINT6) U2.31(PA10)
KERNEL_LED: IC2.B21(PD6/RGMII_NULL/MII_RXERR/RMII_RXER) LED3.A
MCU_3.3V: C58.1 C59.1 C64.1 C67.1 C70.1 C79.1 C82.1 C86.1 C91.1 JP3.16 JP3.17 L3.2 R19.1 R32.2 U2.1(VBAT) U2.9(VDDA/VREF+) U2.24(VDD) U2.36(VDD) U2.48(VDD)
MCU_REG_EN: IC2.H17(PD1/RGMII_RXD2/MII_RXD2/RMII_NULL/DI_RX) IC5.1(EN) R21.1
MCU_RST: C36.2 IC2.B1(PG13/PCM1_DIN/PG_EINT13) JP3.11 R19.2 U2.7(NRST)
N$1 [SDC1]: R9.1 U1.17(SDIO_DATA_CLK)
N$2: JP3.12 R51.2
N$3: IC5.3(LX) L3.1
N$4: LED1.K R37.1
N$5: LED3.K R42.1
N$6: IC6.3(LX) L4.1
N$7: R10.2 U1.34(BT_RST_N)
N$8: IC5.5(FB) R25.2 R32.1
N$9: C15.2 U1.11(XTAL_OUT) Y1.1
N$10: C14.2 U1.10(XTAL_IN) Y1.3
N$11: JP3.13 R49.2
N$12: ANT1.1(FEED) C27.2 L2.2
N$13: LED4.2(DIN) R39.2
N$14: C25.1 L1.2 U1.23(VIN_LDO)
N$15: U2.5(PH0/OSC_IN) Y3.IN
N$16: U2.6(PH1/OSC_OUT) Y3.OUT
N$17: L1.1 U1.21(VIN_LDO_OUT)
N$18: IC6.5(FB) R29.2 R34.1
N$19: IC7.3(LX) L5.1
N$20 [Antenna]: C22.2 L2.1 U1.2(WL_BT_ANT)
N$21: LED2.K R41.1
N$22: C39.1 U2.22(VCAP1)
N$26: IC4.L8(ZQ) R27.1
N$28: C16.1 IC3.1(OUT) Q1.3(D) Q2.1(EMITTER_TR1) X1.VBUS Z4.2
N$33: IC7.5(FB) R30.2 R35.1
N$35 [MPU_X32K]: C49.1 IC2.V5(X32KIN) Q3.1 R24.2
N$36: IC10.3(SW) L7.1
N$37: C103.2 IC10.7(FB) R46.2 R47.1 R48.2
N$38: IC3.3(ISET) R14.2
N$40: IC9.3(LX) L6.1
N$41: IC2.V10(SZQ) R43.2
N$42: IC9.5(FB) R44.2 R45.1
N$44: Q4.3(D) R48.1
N$46: Q1.1(G) Q2.3(COLLECTOR_TR2) R12.2
N$47: Q2.2(BASE_TR1) Q2.5(BASE_TR2) Q2.6(COLLECTOR_TR1) R13.2
N$48 [MPU_X32K]: C50.1 IC2.U4(X32KOUT) Q3.2 R24.1
N$50: C60.1 IC2.H11(VDD_EFUSEBP)
N$51: IC2.AA6(NMI) R26.2
N$52: IC2.AA5(KEYADC) R33.2
N$74: IC4.L9(NC_4) R28.1
PWR_DRAM: IC2.A14(PA21/PCM0_DIN/SIM_VPPPP/PA_EINT21) IC6.1(EN) R22.1
PWR_STB: IC2.A20(PD4/RGMII_RXCK/MII_RXCK/RMII_NULL) IC7.1(EN) IC10.8(EN) R23.1
RESET_SW: IC2.F13(PA8/SIM_DATA/PA_EINT8) R52.2 S2.1 S2.2
SA0 [DRAM_ADD_CMD]: IC2.T17(SA0) IC4.N3(A0)
SA1 [DRAM_ADD_CMD]: IC2.U18(SA1) IC4.P7(A1)
SA2 [DRAM_ADD_CMD]: IC2.V19(SA2) IC4.P3(A2)
SA3 [DRAM_ADD_CMD]: IC2.V20(SA3) IC4.N2(A3)
SA4 [DRAM_ADD_CMD]: IC2.V21(SA4) IC4.P8(A4)
SA5 [DRAM_ADD_CMD]: IC2.Y19(SA5) IC4.P2(A5)
SA6 [DRAM_ADD_CMD]: IC2.Y20(SA6) IC4.R8(A6)
SA7 [DRAM_ADD_CMD]: IC2.V15(SA7) IC4.R2(A7)
SA8 [DRAM_ADD_CMD]: IC2.W18(SA8) IC4.T8(A8)
SA9 [DRAM_ADD_CMD]: IC2.Y18(SA9) IC4.R3(A9)
SA10 [DRAM_ADD_CMD]: IC2.P19(SA10) IC4.L7(A10/AP)
SA11 [DRAM_ADD_CMD]: IC2.N19(SA11) IC4.R7(A11)
SA12 [DRAM_ADD_CMD]: IC2.R18(SA12) IC4.N7(A12/!BC)
SA13 [DRAM_ADD_CMD]: IC2.V12(SA13) IC4.T3(A13)
SA14 [DRAM_ADD_CMD]: IC2.N17(SA14) IC4.T7(A14)
SA15 [DRAM_ADD_CMD]: IC2.R17(SA15) IC4.M7(NC_5)
SBA0 [DRAM_ADD_CMD]: IC2.W17(SBA0) IC4.M2(BA0)
SBA1 [DRAM_ADD_CMD]: IC2.T18(SBA1) IC4.N8(BA1)
SBA2 [DRAM_ADD_CMD]: IC2.V17(SBA2) IC4.M3(BA2)
SCAS [DRAM_ADD_CMD]: IC2.U15(SCAS) IC4.K3(!CAS)
SCK_N [DRAM_CLOCK]: IC2.AA20(SCKB) IC4.K7(!CK) R18.1
SCK_P [DRAM_CLOCK]: IC2.AA19(SCK) IC4.J7(CK) R18.2
SCKE0 [DRAM_CONTROL]: IC2.AA21(SCKE0) IC4.K9(CKE)
SCKE1 [DRAM_CONTROL]: IC2.Y21(SCKE1) IC4.J9(NC_2)
SCS0 [DRAM_CONTROL]: IC2.W20(SCS0) IC4.L2(!CS)
SCS1 [DRAM_CONTROL]: IC2.W21(SCS1) IC4.L1(NC_3)
SDC1_CLK [SDC1]: IC2.J3(PG0/SDC1_CLK/PG_EINT0) R9.2
SDC1_CMD [SDC1]: IC2.L2(PG1/SDC1_CMD/PG_EINT1) R7.2 U1.16(SDIO_DATA_CMD)
SDC1_D0 [SDC1]: IC2.H4(PG2/SDC1_D0/PG_EINT2) R5.2 U1.18(SDIO_DATA_0)
SDC1_D1 [SDC1]: IC2.F3(PG3/SDC1_D1/PG_EINT3) R4.2 U1.19(SDIO_DATA_1)
SDC1_D2 [SDC1]: IC2.C2(PG4/SDC1_D2/PG_EINT4) R2.2 U1.14(SDIO_DATA_2)
SDC1_D3 [SDC1]: IC2.C1(PG5/SDC1_D3/PG_EINT5) R1.2 U1.15(SDIO_DATA_3)
SDQ0 [DRAM_DATA[0]]: IC2.N20(SDQ0) IC4.F7(DQL1)
SDQ1 [DRAM_DATA[0]]: IC2.P21(SDQ1) IC4.H8(DQL5)
SDQ2 [DRAM_DATA[0]]: IC2.P20(SDQ2) IC4.F8(DQL3)
SDQ3 [DRAM_DATA[0]]: IC2.U21(SDQ3) IC4.H3(DQL4)
SDQ4 [DRAM_DATA[0]]: IC2.R19(SDQ4) IC4.H7(DQL7)
SDQ5 [DRAM_DATA[0]]: IC2.T20(SDQ5) IC4.E3(DQL0)
SDQ6 [DRAM_DATA[0]]: IC2.U19(SDQ6) IC4.G2(DQL6)
SDQ7 [DRAM_DATA[0]]: IC2.U20(SDQ7) IC4.F2(DQL2)
SDQ8 [DRAM_DATA[1]]: IC2.J19(SDQ8) IC4.A7(DQU4)
SDQ9 [DRAM_DATA[1]]: IC2.H20(SDQ9) IC4.A2(DQU5)
SDQ10 [DRAM_DATA[1]]: IC2.H21(SDQ10) IC4.A3(DQU7)
SDQ11 [DRAM_DATA[1]]: IC2.J21(SDQ11) IC4.B8(DQU6)
SDQ12 [DRAM_DATA[1]]: IC2.L20(SDQ12) IC4.C8(DQU2)
SDQ13 [DRAM_DATA[1]]: IC2.L21(SDQ13) IC4.D7(DQU0)
SDQ14 [DRAM_DATA[1]]: IC2.M21(SDQ14) IC4.C3(DQU1)
SDQ15 [DRAM_DATA[1]]: IC2.M19(SDQ15) IC4.C2(DQU3)
SDQM0 [DRAM_DATA[0]]: IC2.M20(SDQM0) IC4.E7(DML)
SDQM1 [DRAM_DATA[1]]: IC2.G20(SDQM1) IC4.D3(DMU)
SDQS0_N [DIFF100]: IC2.R21(SDQSB0) IC4.G3(!DQSL)
SDQS0_P [DIFF100]: IC2.R20(SDQS0) IC4.F3(DQSL)
SDQS1_N [DIFF100]: IC2.J20(SDQSB1) IC4.B7(!DQSU)
SDQS1_P [DIFF100]: IC2.K20(SDQS1) IC4.C7(DQSU)
SETUP_SW: IC2.A13(PA20/PCM0_DOUT/SIM_VPPEN/PA_EINT20) IC2.W6(UBOOT) R40.2 S1.1 S1.2
SODT0 [DRAM_CONTROL]: IC2.W11(SODT0) IC4.K1(ODT)
SODT1 [DRAM_CONTROL]: IC2.V11(SODT1) IC4.J1(NC_1)
SRAS [DRAM_ADD_CMD]: IC2.V13(SRAS) IC4.J3(!RAS)
SRST [DRAM_CONTROL]: IC2.U16(SRST) IC4.T2(!RESET)
SVREF: C37.2 C38.1 C51.1 C104.1 IC2.T16(SVREF) IC4.H1(VREFDQ) IC4.M8(VREFCA) R16.1 R17.2
SWE [DRAM_ADD_CMD]: IC2.W13(SWE) IC4.L3(!WE)
UART0_RX: IC2.H6(PA5/UART0_RX/PWM0/PA_EINT5) R51.1
UART0_TX: IC2.F5(PA4/UART0_TX/PA_EINT4) R49.1
USB0_DRVVBUS: IC2.B16(PC2/NAND_CLE/SPI0_CLK) IC3.4(EN) R15.2
USB0_N [DIFF90]: IC2.B5(USB_DM0) X1.D- Z3.2
USB0_OTGID: IC2.D1(PG12/PCM1_DOUT/PG_EINT12) R6.1 X1.ID Z1.2
USB0_P [DIFF90]: IC2.A5(USB_DP0) X1.D+ Z2.2
VDD_CPUFB: C103.1 IC2.T10(VDD_CPUXFB) R47.2
VDD_CPUS: C2.1 C4.1 C53.1 IC2.J7(VDD_CPUS0) IC2.J8(VDD_CPUS1) IC2.M4(RTC_VIO)
VDD_CPUX: C17.1 C18.1 C21.1 C24.1 C28.1 C31.1 C105.1 C106.1 C107.1 IC2.N8(VDD_CPUX0) IC2.P6(VDD_CPUX1) IC2.P7(VDD_CPUX2) IC2.P8(VDD_CPUX3) IC2.P9(VDD_CPUX4) IC2.R6(VDD_CPUX5) IC2.R7(VDD_CPUX6) IC2.R8(VDD_CPUX7) IC2.T6(VDD_CPUX8) IC2.T7(VDD_CPUX9) IC2.T8(VDD_CPUX10) IC2.U6(VDD_CPUX11) IC2.U9(VDD_CPUX12) IC10.5(OUT) L7.2
VDDI_EMMC: C3.2 C7.2 IC1.C2(VDDI)
VIN: C32.1 C40.1 C41.1 C42.1 C43.1 C44.1 C45.1 C46.1 C47.1 C48.1 C93.1 C94.1 C95.1 C96.1 C97.1 C98.1 C99.1 IC3.5(IN) IC5.4(VIN) IC6.4(VIN) IC7.4(IN) IC9.1(EN) IC9.4(VIN) IC10.2(VIN) JP3.18 LED4.1(VDD) Q1.2(S) Q2.4(EMITTER_TR2)
WIFI_32K: IC2.P3(X32KFOUT) R31.2 U1.24(LPO)
WL_REG_ON: IC2.T3(PL7/S_JTAG_SI/S_PL_EINT7) R11.2 U1.12(WL_REG_ON)
WL_WAKE_HOST: IC2.M3(PG10/PCM1_SYNC/PG_EINT10) R8.2 U1.13(WL_HOST_WAKE)
X24_IN [MPU_X24M]: C87.2 IC2.K2(X24MIN) Y2.3
X24_OUT [MPU_X24M]: C88.2 IC2.K1(X24MOUT) Y2.1
Unconnected: ANT1.2(NC) IC1.A1(NC_1) IC1.A2(NC_2) IC1.A7(NC_3) IC1.A8(NC_4) IC1.A9(NC_5) IC1.A10(NC_6) IC1.A11(NC_7) IC1.A12(NC_8) IC1.A13(NC_9) IC1.A14(NC_10) IC1.B1(NC_11) IC1.B7(NC_12) IC1.B8(NC_13) IC1.B9(NC_14) IC1.B10(NC_15) IC1.B11(NC_16) IC1.B12(NC_17) IC1.B13(NC_18) IC1.B14(NC_19) IC1.C1(NC_20) IC1.C3(NC_21) IC1.C5(NC_22) IC1.C7(NC_23) IC1.C8(NC_24) IC1.C9(NC_25) IC1.C10(NC_26) IC1.C11(NC_27) IC1.C12(NC_28) IC1.C13(NC_29) IC1.C14(NC_30) IC1.D1(NC_31) IC1.D2(NC_32) IC1.D3(NC_33) IC1.D4(NC_34) IC1.D12(NC_35) IC1.D13(NC_36) IC1.D14(NC_37) IC1.E1(NC_38) IC1.E2(NC_39) IC1.E3(NC_40) IC1.E5(NC_41) IC1.E8(NC_42) IC1.E9(NC_43) IC1.E10(NC_44) IC1.E12(NC_45) IC1.E13(NC_46) IC1.E14(NC_47) IC1.F1(NC_48) IC1.F2(NC_49) IC1.F3(NC_50) IC1.F10(NC_51) IC1.F12(NC_52) IC1.F13(NC_53) IC1.F14(NC_54) IC1.G1(NC_55) IC1.G2(NC_56) IC1.G3(NC_57) IC1.G10(NC_58) IC1.G12(NC_59) IC1.G13(NC_60) IC1.G14(NC_61) IC1.H1(NC_62) IC1.H2(NC_63) IC1.H3(NC_64) IC1.H5(DATA_STROBE) IC1.H12(NC_65) IC1.H13(NC_66) IC1.H14(NC_67) IC1.J1(NC_68) IC1.J2(NC_69) IC1.J3(NC_70) IC1.J12(NC_71) IC1.J13(NC_72) IC1.J14(NC_73) IC1.K1(NC_74) IC1.K2(NC_75) IC1.K3(NC_76) IC1.K6(NC_77) IC1.K7(NC_78) IC1.K10(NC_79) IC1.K12(NC_80) IC1.K13(NC_81) IC1.K14(NC_82) IC1.L1(NC_83) IC1.L2(NC_84) IC1.L3(NC_85) IC1.L12(NC_86) IC1.L13(NC_87) IC1.L14(NC_88) IC1.M1(NC_89) IC1.M2(NC_90) IC1.M3(NC_91) IC1.M7(NC_92) IC1.M8(NC_93) IC1.M9(NC_94) IC1.M10(NC_95) IC1.M11(NC_96) IC1.M12(NC_97) IC1.M13(NC_98) IC1.M14(NC_99) IC1.N1(NC_100) IC1.N3(NC_101) IC1.N6(NC_102) IC1.N7(NC_103) IC1.N8(NC_104) IC1.N9(NC_105) IC1.N10(NC_106) IC1.N11(NC_107) IC1.N12(NC_108) IC1.N13(NC_109) IC1.N14(NC_110) IC1.P1(NC_111) IC1.P2(NC_112) IC1.P7(NC_113) IC1.P8(NC_114) IC1.P9(NC_115) IC1.P10(NC_116) IC1.P11(NC_117) IC1.P12(NC_118) IC1.P13(NC_119) IC1.P14(NC_120) IC2.A1(JTAG_SEL0) IC2.A2(EPHY_LINK_LED) IC2.A3(EPHY_TXN) IC2.A4(EPHY_RXN) IC2.A7(USB_DP2) IC2.A8(USB_DM2) IC2.A10(PE1/CSI_MCLK/TS_ERR) IC2.A11(PE11/CSI_D7/TS_D7) IC2.A19(PF1/SDC0_D0/JTAG_DI0) IC2.AA2(MICIN2N) IC2.AA3(LINEOUTL) IC2.AA8(SDQ29) IC2.AA9(SDQS3) IC2.AA11(SDQ25) IC2.AA12(SDQM3) IC2.AA14(SDQ21) IC2.AA15(SDQS2) IC2.AA17(SDQ17) IC2.AA18(SDQM2) IC2.B2(JTAG_SEL1) IC2.B3(EPHY_TXP) IC2.B4(EPHY_RXP) IC2.B6(USB_DP1) IC2.B7(USB_DM1) IC2.B8(USB_DP3) IC2.B9(USB_DM3) IC2.B10(PE0/CSI_PCLK/TS_CLK) IC2.B11(PE2/CSI_HSYNC/TS_SYNC) IC2.B12(PE12/CSI_SCK/TWI2_SCK) IC2.B13(PA18/PCM0_SYNC/TWI1_SCK/PA_EINT18) IC2.B14(PA19/PCM0_CLK/TWI1_SDA/PA_EINT19) IC2.B15(PC3/NAND_CE1/SPI0_CS) IC2.B20(PD2/RGMII_RXD1/MII_RXD1/RMII_RXD1) IC2.C5(PE15) IC2.C6(PE14) IC2.C7(PE13/CSI_SDA/TWI2_SDA) IC2.C8(PE7/CSI_D3/TS_D3) IC2.C9(PE4/CSI_D0/TS_D0) IC2.C10(PE3/CSI_VSYNC/TS_DVLD) IC2.C11(PE8/CSI_D4/TS_D4) IC2.C12(PE9/CSI_D5/TS_D5) IC2.C13(PA12/TWI0_SDA/DI_RX/PA_EINT12) IC2.C14(PA17/SPDIF_OUT/PA_EINT17) IC2.C15(PC0/NAND_WE/SPI0_MOSI) IC2.C16(PC1/NAND_ALE/SPI0_MISO) IC2.C20(PF5/SDC0_D2/JTAG_CK0) IC2.C21(PD0/RGMII_RXD3/MII_RXD3/RMII_NULL/DI_TX) IC2.D2(PG11/PCM1_CLK/PG_EINT11) IC2.D5(PA1/UART2_RX/JTAG_CK0/PA_EINT1) IC2.D6(PA2/UART2_RTS/JTAG_DO0/PA_EINT2) IC2.D8(PA7/SIM_CLK/PA_EINT7) IC2.D10(PE6/CSI_D2/TS_D2) IC2.D11(PA0/UART2_TX/JTAG_MS0/PA_EINT0) IC2.D13(PA9/SIM_RST/PA_EINT9) IC2.D15(PA16/SPI1_MISO/UART3_CTS/PA_EINT16) IC2.D19(PF0/SDC0_D1/JTAG_MS0) IC2.D20(PF2/SDC0_CLK/UART0_TX) IC2.E2(HTXCN) IC2.E3(PG9/UART1_CTS/PG_EINT9) IC2.E8(PE10/CSI_D6/TS_D6) IC2.E10(PE5/CSI_D1/TS_D1) IC2.E11(PA10/SIM_DET/PA_EINT10) IC2.E13(PA3/UART2_CTS/JTAG_DI0/PA_EINT3) IC2.E14(PA6/SIM_PWREN/PWM1/PA_EINT6) IC2.E15(PA13/SPI1_CS/UART3_TX/PA_EINT13) IC2.E18(PD7/RGMII_TXD3/MII_TXD3/RMII_NULL) IC2.E19(PD12/RGMII_TXCK/MII_TXCK/RMII_TXCK) IC2.E20(PD8/RGMII_TXD2/MII_TXD2/RMII_NULL) IC2.E21(PF4/SDC0_D3/UART0_RX) IC2.F1(HTX0N) IC2.F2(HTXCP) IC2.F6(EPHY_RTX) IC2.F7(EPHY_SPD_LED) IC2.F10(TVOUT) IC2.F11(PA11/TWI0_SCK/DI_TX/PA_EINT11) IC2.F16(PC4/NAND_CE0) IC2.F18(PF3/SDC0_CMD/JTAG_DO0) IC2.F19(PD5/RGMII_RXCTL/MII_RXDV/RMII_CRS_D) IC2.F20(PD11/RGMII_NULL/MII_CRS/RMII_NULL) IC2.F21(PD9/RGMII_TXD1/MII_TXD1/RMII_TXD1) IC2.G1(HTX0P) IC2.G2(HTX1N) IC2.G5(HCEC) IC2.G12(PA14/SPI1_CLK/UART3_RX/PA_EINT14) IC2.G18(PF6) IC2.H2(HTX1P) IC2.H3(HSCL) IC2.H18(PD3/RGMII_RXD0/MII_RXD0/RMII_RXD0) IC2.H19(PD10/RGMII_TXD0/MII_TXD0/RMII_TXD0) IC2.J1(HTX2P) IC2.J2(HTX2N) IC2.K3(HSDA) IC2.K4(X24MFOUT) IC2.K17(PD13/RGMII_TXCTL/MII_TXEN/RMII_TXEN) IC2.K18(PD15/RGMII_CLKIN/MII_COL/RMII_NULL) IC2.L5(PLLTEST) IC2.L17(PD14/RGMII_NULL/MII_TXERR/RMII_NULL) IC2.L18(PD16/MDC) IC2.L19(PD17/MDIO) IC2.M1(PL1/S_TWI_SDA/S_PL_EINT1) IC2.M2(HHPD) IC2.M6(PL9/S_PL_EINT9) IC2.N1(PL0/S_TWI_SCK/S_PL_EINT0) IC2.N2(PL4/S_JTAG_MS/S_PL_EINT4) IC2.P2(PL2/S_UART_TX/S_PL_EINT2) IC2.R1(PL3/S_UART_RX/S_PL_EINT3) IC2.R2(PL5/S_JTAG_CK/S_PL_EINT5) IC2.T2(PL8/S_PL_EINT8) IC2.T4(PL6/S_JTAG_DO/S_PL_EINT6) IC2.T5(TEST) IC2.U2(PL11/S_CIR_RX/S_PL_EINT11) IC2.V1(LINEINL) IC2.V2(PL10/S_PWM/S_PL_EINT10) IC2.V4(VRP) IC2.W1(LINEINR) IC2.W2(MICIN1P) IC2.W3(MBIAS) IC2.W5(VRA2) IC2.W9(SDQ28) IC2.W12(SDQ24) IC2.W15(SDQ19) IC2.Y1(MICIN1N) IC2.Y2(MICIN2P) IC2.Y3(LINEOUTR) IC2.Y4(VRA1) IC2.Y7(SDQ31) IC2.Y8(SDQ30) IC2.Y9(SDQSB3) IC2.Y10(SDQ27) IC2.Y11(SDQ26) IC2.Y12(SDQ23) IC2.Y13(SDQ22) IC2.Y14(SDQ20) IC2.Y15(SDQSB2) IC2.Y16(SDQ18) IC2.Y17(SDQ16) IC10.1(PG) LED4.3(DOUT) U1.4(FM_RX) U1.5(NC1) U1.6(BT_WAKE) U1.7(BT_HOST_WAKE) U1.8(NC2) U1.25(PCM_OUT) U1.26(PCM_CLK) U1.27(PCM_IN) U1.28(PCM_SYNC) U1.29(NC3) U1.30(NC4) U1.32(NC5) U1.35(NC6) U1.37(GPIO4) U1.38(GPIO3) U1.39(GPIO2) U1.40(GPIO1) U1.41(UART_RTS_N) U1.42(UART_TXD) U1.43(UART_RXD) U1.44(UART_CTS_N) U1.TP1 U1.TP2 U1.TP3 U2.2(PC13) U2.3(PC14/OSC32_IN) U2.4(PC15/OSC32_OUT)

## Notes on the sheet
- MPU Decoupling Capacitors
- 1.5V | 1.2V
- Bottom Side Caps
- 3.3V | CPUX
- Power LED
- USB Connector | Microprocessor Interfaces
- MCU Voltage Regulator 3.3V /1A
- MODE
- PWRON/WORK | STANDBY | PWROFF
- STATE
- Kernel LED
- PWR-STB | 1 | 0 | 0
- PWR-DRAM | 1 | 1 | 0
- USER RGB LED
- RESET Switch
- SETUP Switch
- VCC-CPUX 1.1V/3A
- DRAM 1.5V/1A
- GPIOL6/CPUX-VSET = 0, VDD-CPUX=1.1V
  GPIOL6/CPUX-VSET = 1, VDD-CPUX=1.3V
- VDD-SYS 1.2V/2A
- VCC-IO 3.3V/1A
- User Microcontroller | Decoupling Capacitors
- Pin Headers
- MCU_USART1_TX
- MCU_USART1_RX | VDD & VSS
- VDDA & VSSA
  Pin 8 & 9
- Boot1
- User LED
- WiFi Module - AP6212 | DDR3 RAM
- Diff100
- Diff100 - 25 mils - Clock-200 : Clock
- Diff100

## Library data of the parts
ANT1 = AMCA31-2R450G-S1F-T3:AMCA31-2R450G-S1F-T3: ABRACON - AMCA31-2R450G-S1F-T3 - ANTENNA, CHIP, 2.45GHZ, 50 OHM, 1206 Source: Datasheet <http://www.abracon.com/chip-antenna/AMCA31-2R450G-S1F-T.pdf>; DESCRIPTION: ABRACON - AMCA31-2R450G-S1F-T3 - ANTENNA, CHIP, 2.45GHZ, 50 OHM, 1206; HEIGHT: 1.4mm; MANUFACTURER_NAME: ABRACON; MANUFACTURER_PART_NUMBER: AMCA31-2R450G-S1F-T3; MOUSER_PART_NUMBER: 815-CA312R450GS1FT3; MOUSER_PRICE-STOCK: https://www.mouser.com/Search/Refine.aspx?Keyword=815-CA312R450GS1FT3
C1-C16 C19-C104 C107 C108 = GHI-BasicComponents:CAPACITOR-(INCH)-: Basic SMD ceramic capacitors
C17 C18 C105 C106 = GHI-BasicComponents:TOLBA_CAP
IC1 = KLM8G1GESD-B03P:KLM8G1GESD-B03P: 64 Gb MLC x 1 11.5 mm x 13 mm x 0.8 mm 153 FBGA Source: Datasheet <http://file2.dzsc.com/product/17/06/23/1027890_143842759.pdf>; DESCRIPTION: 64 Gb MLC x 1 11.5 mm x 13 mm x 0.8 mm 153 FBGA; HEIGHT: 0.8mm; MANUFACTURER_NAME: Samsung; MANUFACTURER_PART_NUMBER: KLM8G1GESD-B03P
IC2 = Allwinner_H3:ALLWINNER--H3: QUAD-CORE OTT BOX PROCESSOR Source: Datasheet <http://linux-sunxi.org/images/4/4b/Allwinner_H3_Datasheet_V1.2.pdf>; DESCRIPTION: QUAD-CORE OTT BOX PROCESSOR; HEIGHT: 1.18mm; MANUFACTURER_NAME: Allwinner Technology; MANUFACTURER_PART_NUMBER: Allwinner H3
IC3 = SY6280:SY6280: Low Loss Power Distribution Switch Source: Datasheet <https://cdn.datasheetspdf.com/pdf-down/S/Y/6/SY6280-Silergy.pdf>; DESCRIPTION: Low Loss Power Distribution Switch; HEIGHT: 1.4mm; MANUFACTURER_NAME: Silergy; MANUFACTURER_PART_NUMBER: SY6280
IC4 = K4B4G1646B-BCK0:K4B4G1646B-BCK0: 4Gb B-die DDR3 SDRAM Source: Datasheet <http://www.mt-system.ru/sites/default/files/docs/samsung/k4b4g1646b_rev10-1.pdf>; DESCRIPTION: 4Gb B-die DDR3 SDRAM; HEIGHT: 1.2mm; MANUFACTURER_NAME: Samsung; MANUFACTURER_PART_NUMBER: K4B4G1646B-BCK0
IC5 IC6 IC9 = RT8059GJ5:RT8059GJ5: RICHTEK - RT8059GJ5 - IC,DC-DC CONVERTER,BUCK,1.5MHZ,TSOT-23-5 Source: Datasheet <http://www.farnell.com/datasheets/1756324.pdf>; DESCRIPTION: RICHTEK - RT8059GJ5 - IC,DC-DC CONVERTER,BUCK,1.5MHZ,TSOT-23-5; HEIGHT: 1mm; MANUFACTURER_NAME: RICHTEK; MANUFACTURER_PART_NUMBER: RT8059GJ5
IC7 = SY8089A:SY8089A: High Efficiency 5.5V, 2A continuous, 3A peak, 1MHz Synchronous Step Down Regulator Source: Datasheet <https://datasheet.lcsc.com/szlcsc/SY8089AAAC_C78988.pdf>; DESCRIPTION: High Efficiency 5.5V, 2A continuous, 3A peak, 1MHz Synchronous Step Down Regulator; HEIGHT: 1.4mm; MANUFACTURER_NAME: Silergy; MANUFACTURER_PART_NUMBER: SY8089A
IC8 = NCP803SN263T1G:NCP803SN263T1G: Source: Datasheet <http://www.onsemi.com/pub/Collateral/MAX803-D.PDF>; ALLIED_NUMBER: 70467153; ALLIED_PRICE-STOCK: http://www.alliedelec.com/on-semiconductor-ncp803sn263t1g/70467153/; HEIGHT: 1.11mm; MANUFACTURER_NAME: ON Semiconductor; MANUFACTURER_PART_NUMBER: NCP803SN263T1G; MOUSER_PART_NUMBER: 863-NCP803SN263T1G; MOUSER_PRICE-STOCK: https://www.mouser.com/Search/Refine.aspx?Keyword=863-NCP803SN263T1G; RS_PART_NUMBER: 8024341P; RS_PRICE-STOCK: http://uk.rs-online.com/web/p/products/8024341P
IC10 = MP2143DJ-LF-P:MP2143DJ-LF-P: Switching Voltage Regulators 3A, 5.5V, 1.2MHz Sync Stp-Dwn Swtchr Source: Datasheet <https://www.monolithicpower.com/pub/media/document/MP2143_r1.07.pdf>; DESCRIPTION: Switching Voltage Regulators 3A, 5.5V, 1.2MHz Sync Stp-Dwn Swtchr; HEIGHT: 1mm; MANUFACTURER_NAME: Monolithic Power Systems (MPS); MANUFACTURER_PART_NUMBER: MP2143DJ-LF-P; MOUSER_PART_NUMBER: 946-MP2143DJLFP; MOUSER_PRICE-STOCK: https://www.mouser.com/Search/Refine.aspx?Keyword=946-MP2143DJLFP
JP2 JP3 = pinhead-2:PINHD-1X18: PIN HEADER
L1 = DFE252010P-2R2M=P2:DFE252010P-4R7M=P2
L2 = Nordic_nRF:INDUCTOR: Generic chip inductor
L3-L7 = DFE252010P-2R2M=P2:DFE252010P-2R2M=P2: Toko DFE252010P Series Shielded Wire-wound SMD Inductor with a Powered Iron Core, 2.2 uH Wire-Wound 2.9A Idc Source: Datasheet <https://www.murata.com/~/media/webrenewal/products/inductor/chip/tokoproducts/wirewoundmetalalloychiptype/m_dfe252010p.ashx>; DESCRIPTION: Toko DFE252010P Series Shielded Wire-wound SMD Inductor with a Powered Iron Core, 2.2 uH Wire-Wound 2.9A Idc; HEIGHT: 1mm; MANUFACTURER_NAME: Murata Electronics; MANUFACTURER_PART_NUMBER: DFE252010P-2R2M=P2; MOUSER_PART_NUMBER: 81-DFE252010P-2R2MP2; MOUSER_PRICE-STOCK: https://www.mouser.com/Search/Refine.aspx?Keyword=81-DFE252010P-2R2MP2; RS_PART_NUMBER: 1670595; RS_PRICE-STOCK: http://uk.rs-online.com/web/p/products/1670595
LED1-LED3 = GHI-BasicComponents:LED-(INCH)-
LED4 = LTST-E263CEGBK:LTST-E263CEGBK
Q1 = AO3415A:AO3415A: 20V P-Channel MOSFET Source: Datasheet <http://www.aosmd.com/pdfs/datasheet/AO3415A.pdf>; DESCRIPTION: 20V P-Channel MOSFET; HEIGHT: 1.25mm; MANUFACTURER_NAME: Alpha & Omega Semiconductors; MANUFACTURER_PART_NUMBER: AO3415A
Q2 = BCM856BS:BCM856BS: NEXPERIA - BCM856BS - TRANSISTOR,PNP/PNP MATCHED,SOT363 Source: Datasheet <https://componentsearchengine.com/Datasheets/2/BCM856BS.pdf>; DESCRIPTION: NEXPERIA - BCM856BS - TRANSISTOR,PNP/PNP MATCHED,SOT363; HEIGHT: 1.1mm; MANUFACTURER_NAME: Nexperia; MANUFACTURER_PART_NUMBER: BCM856BS; MOUSER_PART_NUMBER: N/A; MOUSER_PRICE-STOCK: https://www.mouser.com/Search/Refine.aspx?Keyword=N%2FA; RS_PART_NUMBER: 7816736; RS_PRICE-STOCK: http://uk.rs-online.com/web/p/products/7816736
Q3 = crystal-geyer_V1_0:KX-327: Tuning Fork Crystals (kHz) SMD: KX327 - Serie Model Size l/w/h [mm] Frequency Range Frequency Stability Temp. Range [°C] Load Capacitance AECQ 200 availabel Datasheet KX-327VT KX-327FT KX-327RT KX-327NHT KX-327NHF KX-327L KX-327S 1.25/1.05/0.5 1.6/1.0/0.5 2.0/1.2/0.6 3.2/1.5/0.8 3.2/1.5/0.8 7.0/1.5/1.4 8.2/3.8/2.5 32,768 kHz 32,768 kHz 32,768 kHz 32,768 kHz 32,768 kHz 32,768 kHz 32,768 kHz ±10 … ±20ppm ±10 … ±20ppm ±10 … ±20ppm ±10 … ±20ppm ±10 … ±20ppm ±10 … ±20ppm ±5 … ±20ppm (*) -40°C …+85°C (*) -40°C …+85°C (*) -40°C …+85°C (*) -40°C …+85°C (*) -40°C …+125°C (*) -40°C …+85°C (*) -40°C …+85°C 7/9/12,5 7/9/12,5 7/9/12,6 7/9/12,5 9/12,5 7/9/12,5 6/12,5 - - - - yes - - KX-327VT.pdf <http://www.geyer-electronic.de/uploads/tx_userartikelfrequenz/GEYER-KX-327VT.pdf> KX-327FT.pdf <http://www.geyer-electronic.de/uploads/tx_userartikelfrequenz/GEYER-KX-327FT.pdf> KX-327RT.pdf <http://www.geyer-electronic.de/uploads/tx_userartikelfrequenz/GEYER-KX-327RT.pdf> KX-327NHT.pdf <http://www.geyer-electronic.de/uploads/tx_userartikelfrequenz/GEYER-KX-327NHT.pdf> KX-327NHF.pdf <http://www.geyer-electronic.de/uploads/tx_userartikelfrequenz/GEYER-KX-327NHF.pdf> KX-327L.pdf <http://www.geyer-electronic.de/uploads/tx_userartikelfrequenz/GEYER-KX-327L.pdf> KX-327S.pdf <http://www.geyer-electronic.de/uploads/tx_userartikelfrequenz/GEYER-KX-327S.pdf> <http://www.geyer-electronic.de/fileadmin/template/img/logo-geyer-electronic.png> Details see: http://www.geyer-electronic.de/Frequenz-Produkte.9.0.html Created 2016-06-07, Hans Locher 2016 (C) Geyer Quartz Technology KX327VT,KX327FT,KX327RT,KX327NHT,KX327NHF,KX327S,KX327L;125105;1610;2012;3215;7015;8238;1,25x1,05,1.25x1.05;1,6x1,0,1.6x1.0;2,0x1,2,2.0x1.2;3,2x1,5,3.2x1.5;8,2x3,8,8.2x3.8,7.0x1.5,7,0x1,532.768kHz
Q4 = L2N7002WT1G:L2N7002WT1G: Small Signal MOSFET 115 mAmps, 60 Volts NChannel SC-70 Source: Datasheet <http://www.lrc.cn/data/pdf/L2N7002WT1G.pdf>; DESCRIPTION: Small Signal MOSFET 115 mAmps, 60 Volts NChannel SC-70; HEIGHT: 1mm; MANUFACTURER_NAME: LRC; MANUFACTURER_PART_NUMBER: L2N7002WT1G; MOUSER_PART_NUMBER: N/A; MOUSER_PRICE-STOCK: https://www.mouser.com/Search/Refine.aspx?Keyword=N%2FA
R1-R35 R37-R52 = GHI-BasicComponents:RESISTOR-(INCH)-: Basic SMD Resistors
S1 S2 = Spark:TAC_SWITCH: SMD Tactiile Switch
U1 = AMPAK Modules:AP6212
U2 = STM32F411xx:STM32F411CEU6
X1 = GHI-Connectors:10118192-0001LF: Amphenol FCI Micro USB Type B Complete Surface Mount (SMT) no guide holes
Y1 = FA-128 26.0000MF10Z-W5:FA-12826.0000MF10Z-W5
Y2 = SparkFun-Clocks:CRYSTAL-24MHZ-EPSON-TSX-3225: 24MHz Crystal Datasheet <http://www.sparkfun.com/datasheets/Components/AT-SMD-5x3.pdf> Frequency: 24MHz Frequency Tolerance: ±20ppm Load Capacitance: 12pF SparkFun Products: USB Bit Whacker <https://www.sparkfun.com/products/762>
Y3 = Tolba_Resonators:CSTCW25M0X53-R0
Z1-Z4 = SparkFun:VARISTOR: Varistor Varistor (Variable resistor) is a nonlinear resistive element of the voltage dependence that resistance changes with applied voltage. Varistor is equivalent with Zener diode of two series connection.

## Net classes
1 DRAM_ADD_CMD: width 0.102 mm
5 DRAM_CLOCK: width 0.114 mm, clearance 0.305 mm to class 0, clearance 0.305 mm to class 1, clearance 0.305 mm to class 2, clearance 0.305 mm to class 3, clearance 0.305 mm to class 4, clearance 0.121 mm
6 DIFF100: width 0.114 mm, clearance 0.305 mm to class 0, clearance 0.305 mm to class 1, clearance 0.305 mm to class 2, clearance 0.305 mm to class 3, clearance 0.305 mm to class 4, clearance 0.305 mm to class 5, clearance 0.121 mm
7 DIFF90: width 0.135 mm, clearance 0.305 mm to class 0, clearance 0.305 mm to class 1, clearance 0.305 mm to class 2, clearance 0.305 mm to class 3, clearance 0.305 mm to class 4, clearance 0.305 mm to class 5, clearance 0.305 mm to class 6, clearance 0.109 mm
8 SDC2: clearance 0.305 mm to class 5, clearance 0.305 mm to class 6, clearance 0.305 mm to class 7
9 SDC1: clearance 0.305 mm to class 5, clearance 0.305 mm to class 6, clearance 0.305 mm to class 7
10 1.2V: clearance 0.305 mm to class 5, clearance 0.305 mm to class 6, clearance 0.305 mm to class 7
11 1.5V: clearance 0.305 mm to class 5, clearance 0.305 mm to class 6, clearance 0.305 mm to class 7
12 3.3V: clearance 0.305 mm to class 5, clearance 0.305 mm to class 6, clearance 0.305 mm to class 7
13 Antenna: width 0.179 mm, clearance 0.102 mm to class 0, clearance 0.305 mm to class 5, clearance 0.305 mm to class 6, clearance 0.305 mm to class 7
14 MPU_X24M: clearance 0.305 mm to class 5, clearance 0.305 mm to class 6, clearance 0.305 mm to class 7
15 MPU_X32K: clearance 0.305 mm to class 5, clearance 0.305 mm to class 6, clearance 0.305 mm to class 7